# EasyEDA Pro project Flyback_circuit_2024-07-31.epro

# Schematic Schematic1

## Sheets
1 DC_in: Create Date: 2024-07-19; Page Name: DC_in.Schematic1; Project Name: Flyback_circuit; Schematic Name: Schematic1; Update Date: 2024-07-20; Company: 嘉立创EDA; Page Size: A4; Version: V1.0
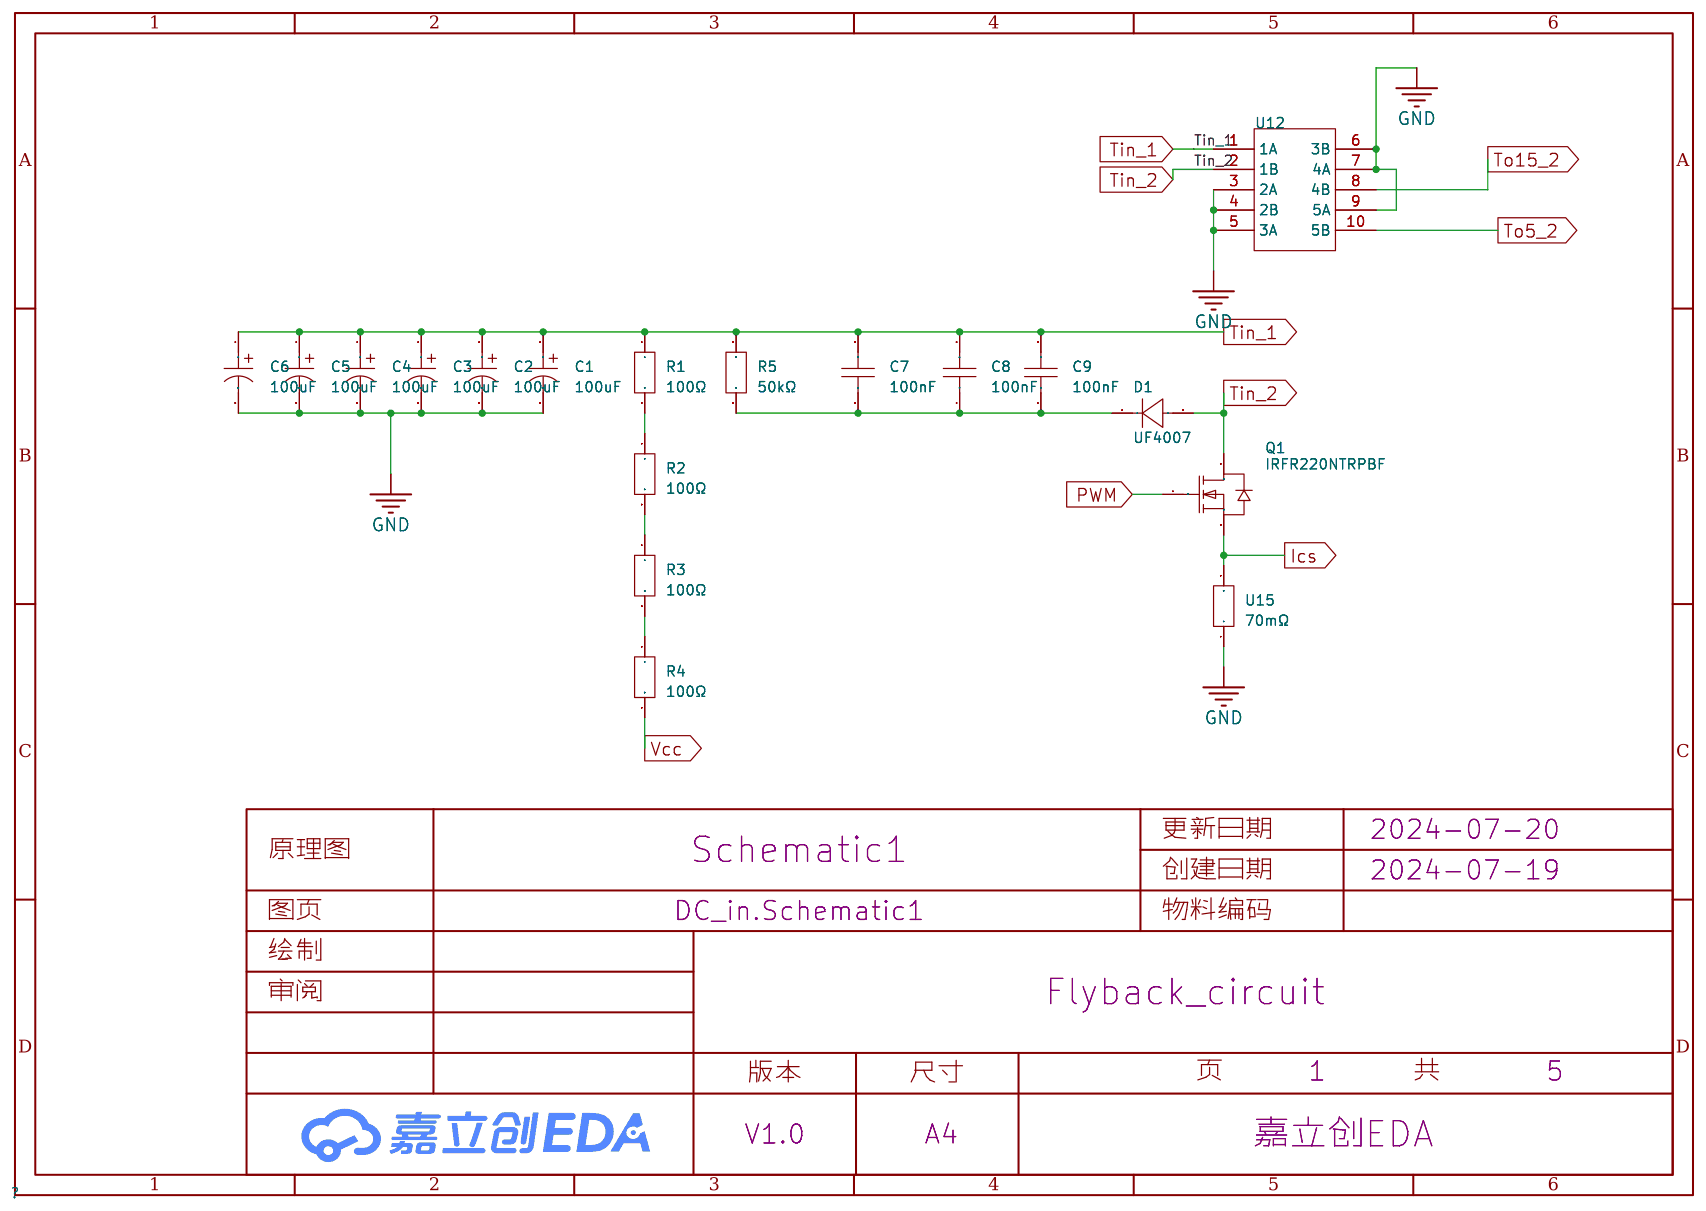
[diagram p0: DC_in]
2 DC_out_5v: Create Date: 2024-07-20; Page Name: DC_out_5v; Update Date: 2024-07-21
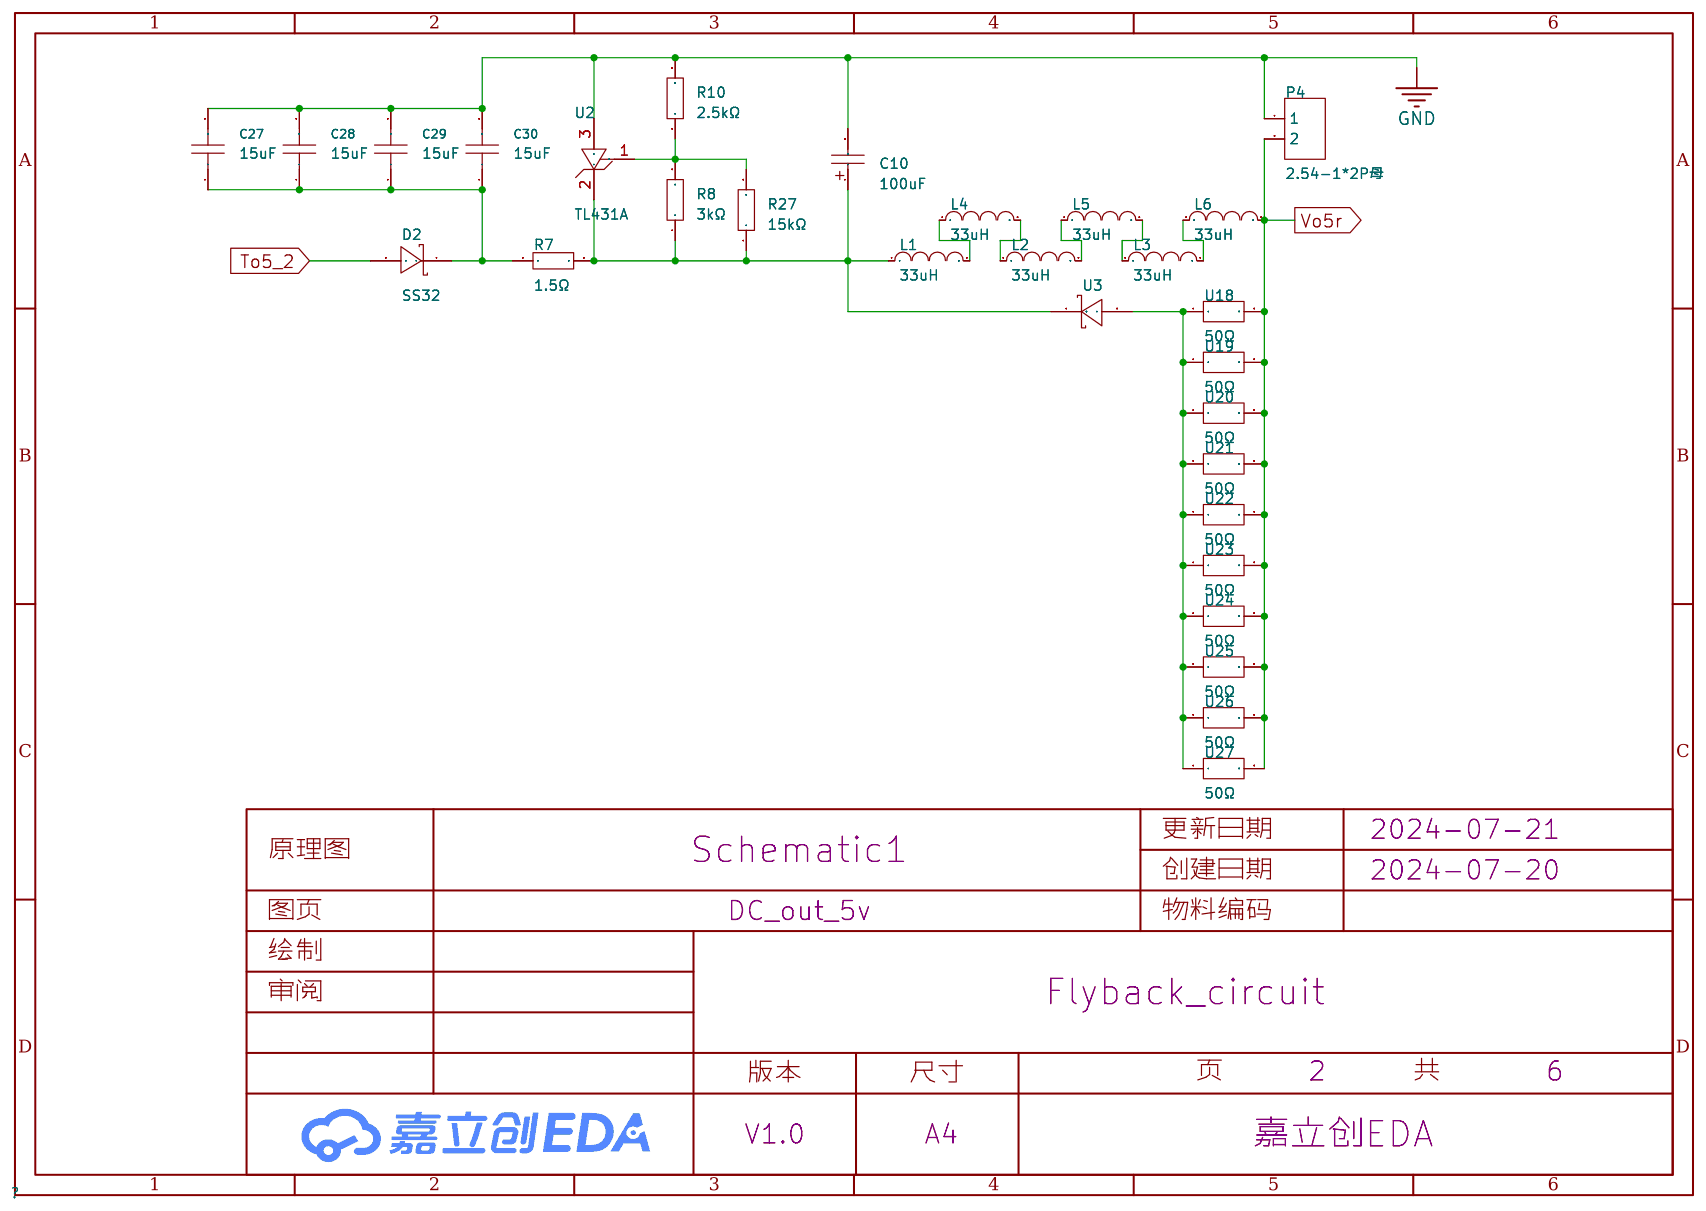
[diagram p1: DC_out_5v]
3 DC_out_15v: Create Date: 2024-07-20; Page Name: DC_out_15v.Schematic1
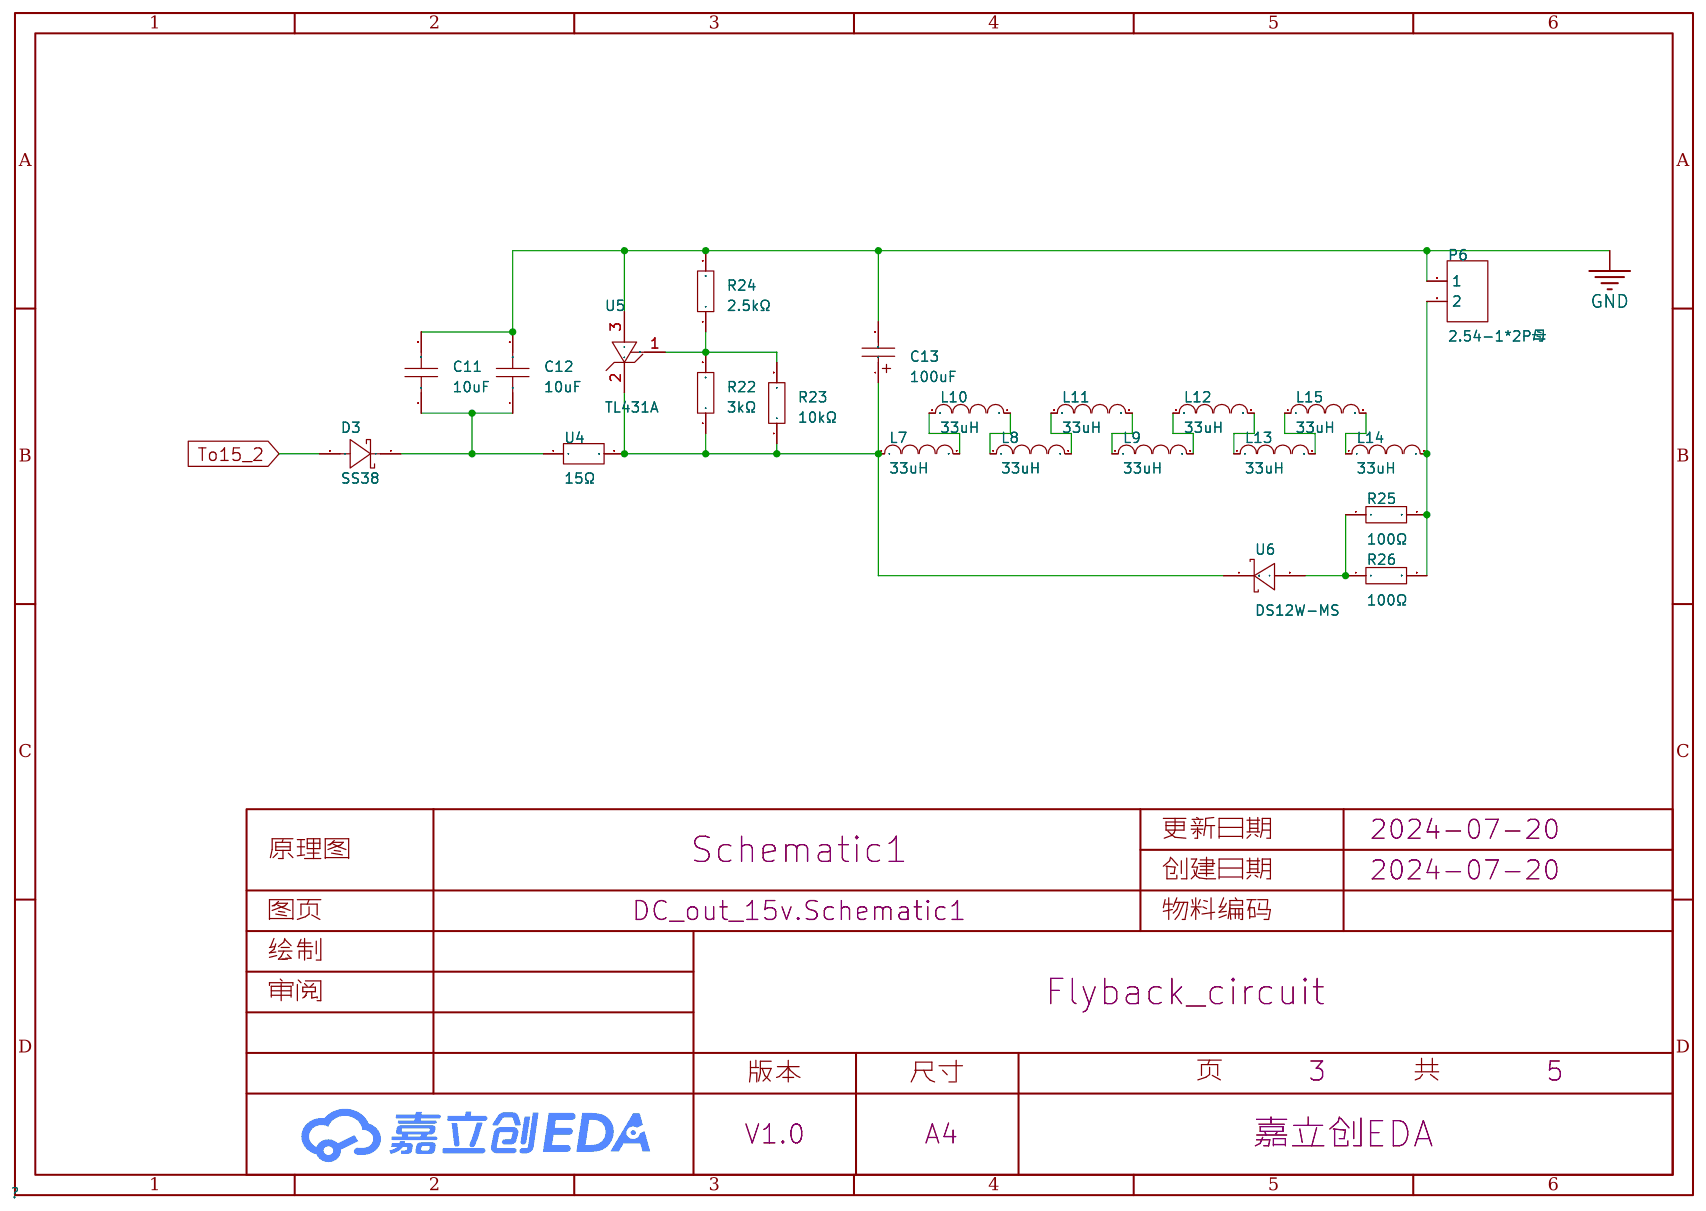
[diagram p2: DC_out_15v]
4 Sample_Circuit: Create Date: 2024-07-20; Page Name: Sample_Circuit; Update Date: 2024-07-21
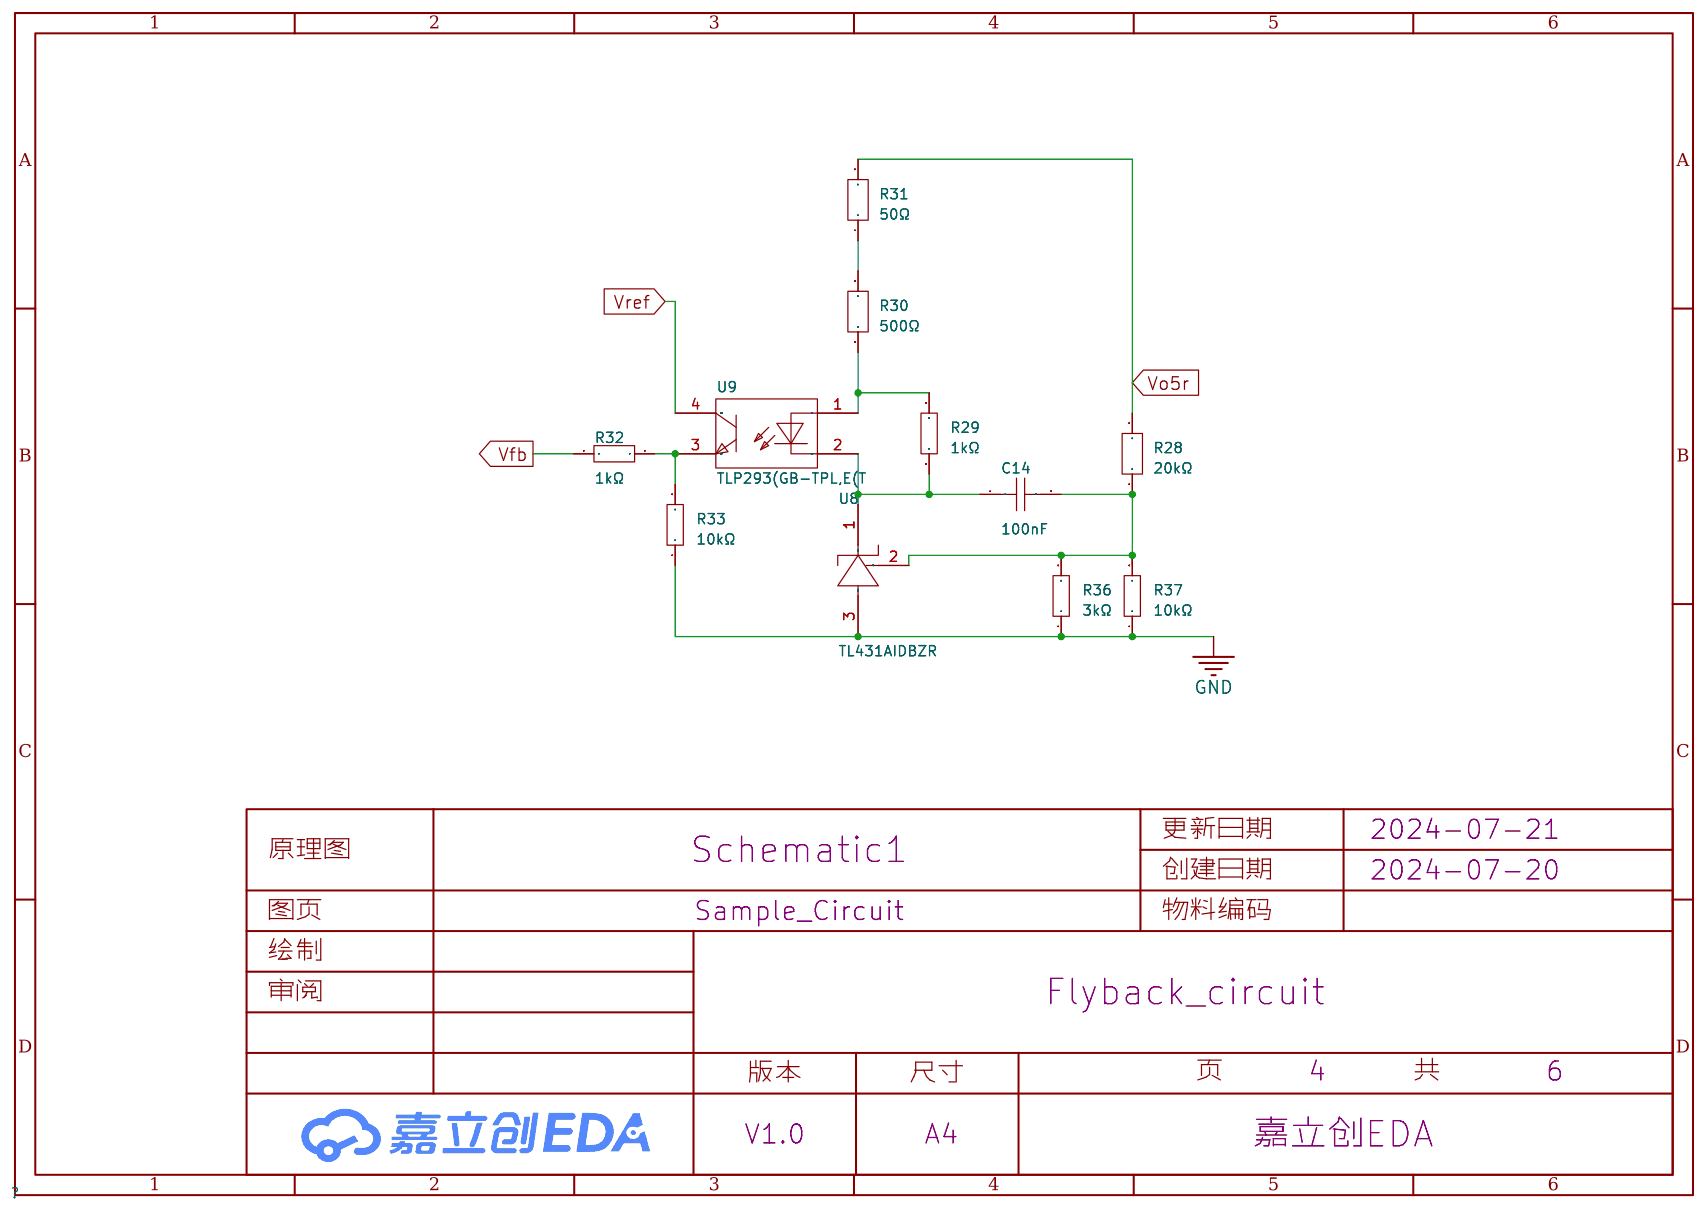
[diagram p3: Sample_Circuit]
5 Chip_Circuit: Create Date: 2024-07-20; Page Name: Chip_Circuit.Schematic1
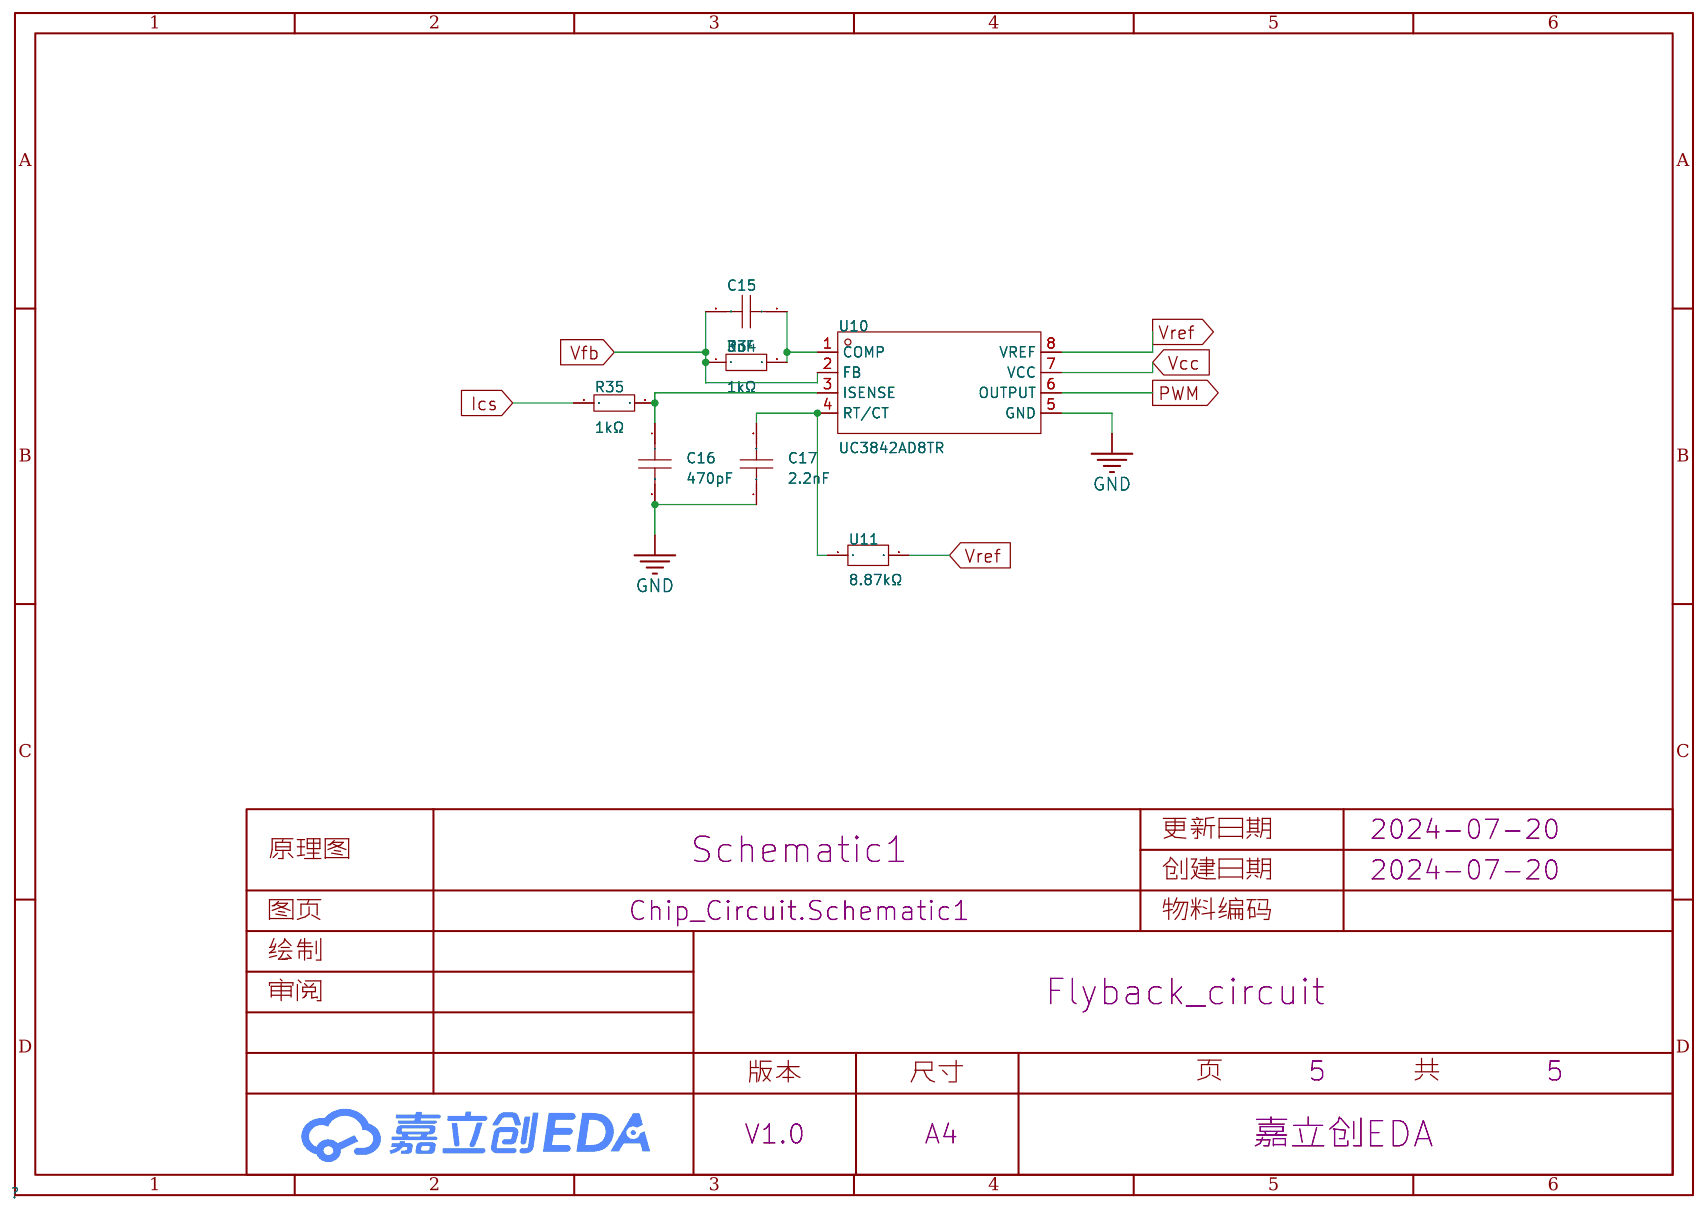
[diagram p4: Chip_Circuit]
6 AC2DC: Create Date: 2024-07-20; Page Name: AC2DC
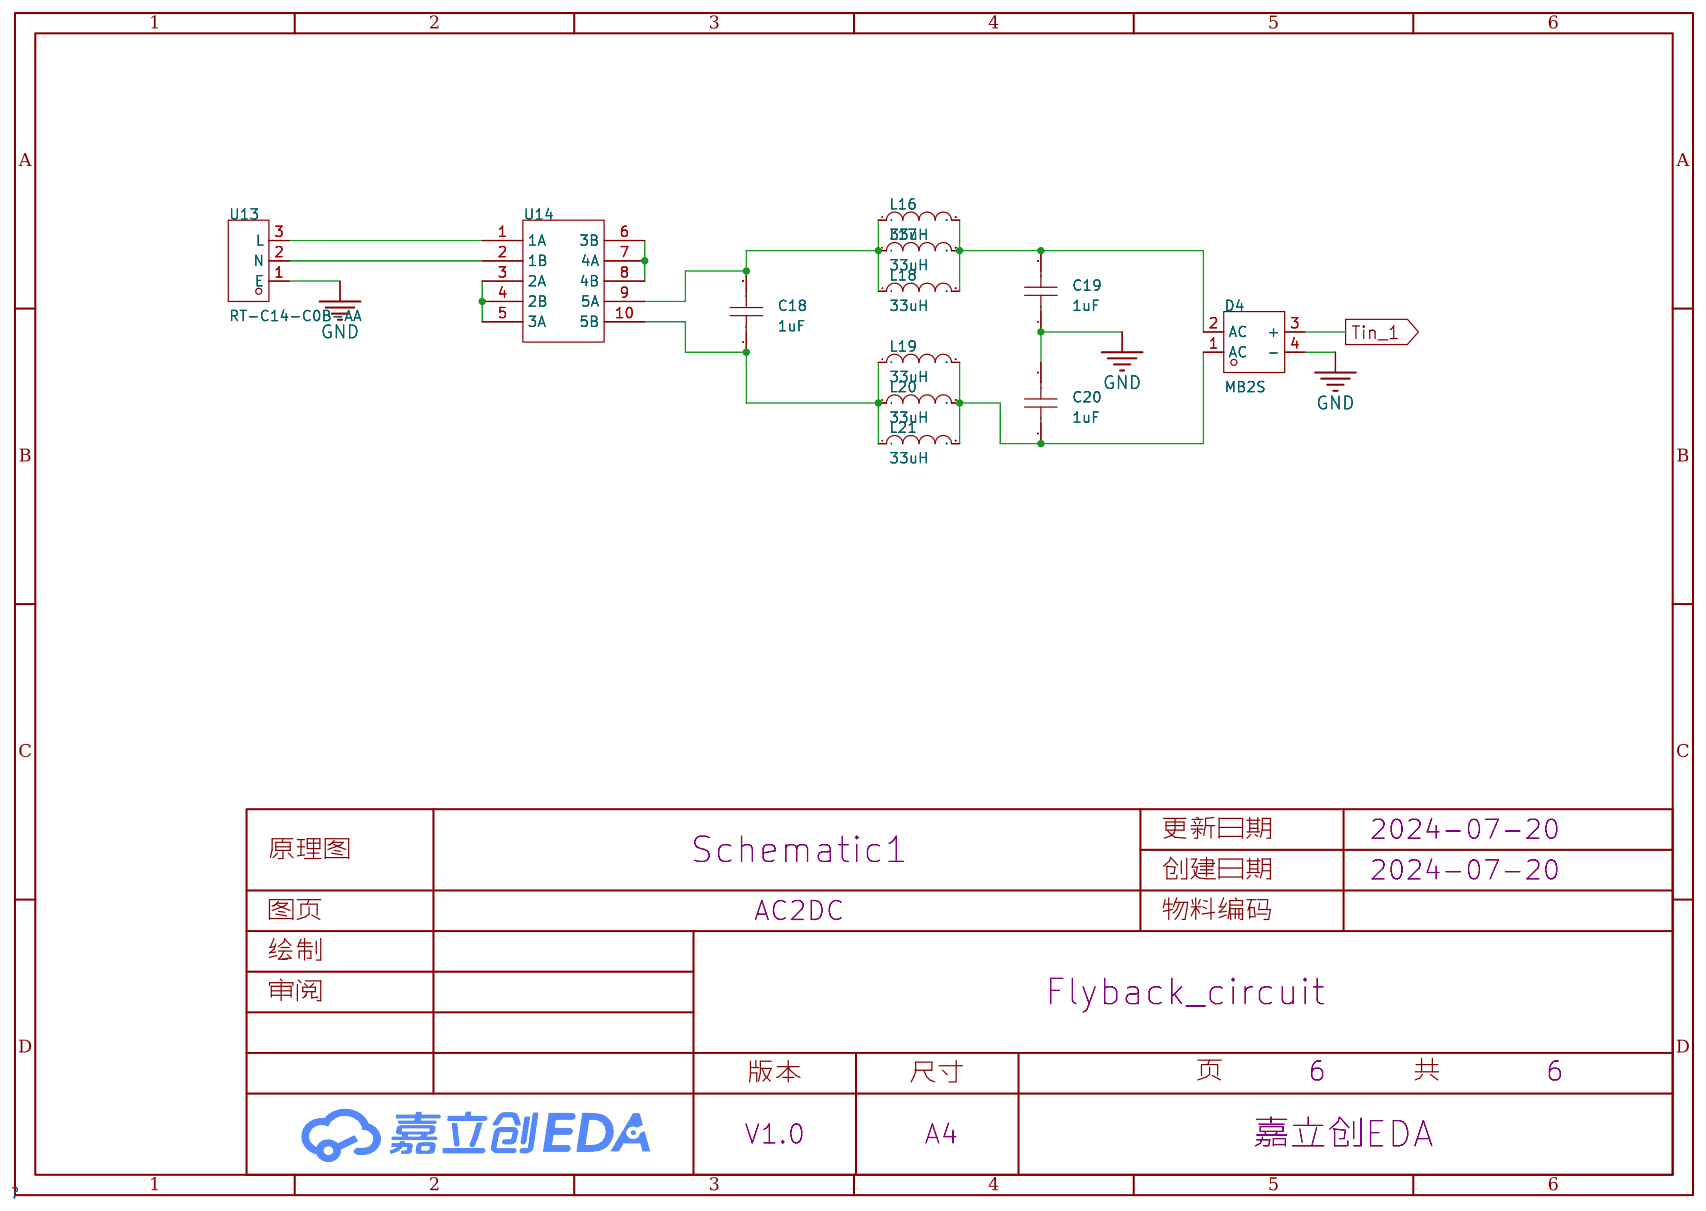
[diagram p5: AC2DC]

## Parts
sheet AC2DC
C18  1uF  [C1206]
C19  1uF  [C1206]
C20  1uF  [C1206]
D4  MB2S  [MBS_L4.7-W4.0-P2.50-LS7.0-BL]
L16  33uH  [IND-SMD_L7.0-W6.6_FXL0650]
L17  33uH  [IND-SMD_L7.0-W6.6_FXL0650]
L18  33uH  [IND-SMD_L7.0-W6.6_FXL0650]
L19  33uH  [IND-SMD_L7.0-W6.6_FXL0650]
L20  33uH  [IND-SMD_L7.0-W6.6_FXL0650]
L21  33uH  [IND-SMD_L7.0-W6.6_FXL0650]
U13  RT-C14-C0B-AA  [AC-TH_RT-C14-C0B-AA]
U14  -  [反激变压器_封装]
sheet Chip_Circuit
C15  3nF  [C0402]
C16  470pF  [C0805]
C17  2.2nF  [C0603]
R34  1kΩ  [R0603]
R35  1kΩ  [R0603]
U10  UC3842AD8TR  [SOIC-8_L4.9-W3.9-P1.27-LS6.0-BL]
U11  8.87kΩ  [R0603]
sheet DC_in
C1  100uF  [CAP-SMD_BD6.3-L6.6-W6.6-LS7.4-FD]
C2  100uF  [CAP-SMD_BD6.3-L6.6-W6.6-LS7.4-FD]
C3  100uF  [CAP-SMD_BD6.3-L6.6-W6.6-LS7.4-FD]
C4  100uF  [CAP-SMD_BD6.3-L6.6-W6.6-LS7.4-FD]
C5  100uF  [CAP-SMD_BD6.3-L6.6-W6.6-LS7.4-FD]
C6  100uF  [CAP-SMD_BD6.3-L6.6-W6.6-LS7.4-FD]
C7  100nF  [C0603]
C8  100nF  [C0603]
C9  100nF  [C0603]
D1  UF4007  [DO-41_BD2.4-L4.7-P8.70-D0.9-RD]
Q1  IRFR220NTRPBF  [TO-252-2_L6.6-W6.1-P4.57-LS9.9-TR-CW]
R1  100Ω  [R2010]
R2  100Ω  [R2010]
R3  100Ω  [R2010]
R4  100Ω  [R2010]
R5  50kΩ  [R0805]
U12  -  [反激变压器_封装]
U15  70mΩ  [R1206]
sheet DC_out_5v
C10  100uF  [CAP-SMD_L3.5-W2.8-R-RD]
C27  15uF  [CAP-TH_L5.5-W4.0-P2.50-D1.0]
C28  15uF  [CAP-TH_L5.5-W4.0-P2.50-D1.0]
C29  15uF  [CAP-TH_L5.5-W4.0-P2.50-D1.0]
C30  15uF  [CAP-TH_L5.5-W4.0-P2.50-D1.0]
D2  SS32  [SMA_L4.3-W2.6-LS5.2-RD]
L1  33uH  [IND-SMD_L7.0-W6.6_FXL0630]
L2  33uH  [IND-SMD_L7.0-W6.6_FXL0630]
L3  33uH  [IND-SMD_L7.0-W6.6_FXL0630]
L4  33uH  [IND-SMD_L7.0-W6.6_FXL0630]
L5  33uH  [IND-SMD_L7.0-W6.6_FXL0630]
L6  33uH  [IND-SMD_L7.0-W6.6_FXL0630]
P4  2.54-1*2P母  [HDR-TH_2P-P2.54-V-F]
R7  1.5Ω  [RES-TH_BD1.9-L3.3-P7.30-D0.5]
R8  3kΩ  [R0402]
R10  2.5kΩ  [R0603]
R27  15kΩ  [R0603]
U2  TL431A  [SOT-23-3_L2.9-W1.3-P1.90-LS2.4-BR]
U3  DS12W-MS  [SOD-123FL_L2.7-W1.8-LS3.8-RD]
U18  50Ω  [R0603]
U19  50Ω  [R0603]
U20  50Ω  [R0603]
U21  50Ω  [R0603]
U22  50Ω  [R0603]
U23  50Ω  [R0603]
U24  50Ω  [R0603]
U25  50Ω  [R0603]
U26  50Ω  [R0603]
U27  50Ω  [R0603]
sheet DC_out_15v
C11  10uF  [C1210]
C12  10uF  [C1210]
C13  100uF  [CASE-D_7343]
D3  SS38  [SMA_L4.3-W2.6-LS5.0-RD]
L7  33uH  [IND-SMD_L7.0-W6.6_FXL0630]
L8  33uH  [IND-SMD_L7.0-W6.6_FXL0630]
L9  33uH  [IND-SMD_L7.0-W6.6_FXL0630]
L10  33uH  [IND-SMD_L7.0-W6.6_FXL0630]
L11  33uH  [IND-SMD_L7.0-W6.6_FXL0630]
L12  33uH  [IND-SMD_L7.0-W6.6_FXL0630]
L13  33uH  [IND-SMD_L7.0-W6.6_FXL0630]
L14  33uH  [IND-SMD_L7.0-W6.6_FXL0630]
L15  33uH  [IND-SMD_L7.0-W6.6_FXL0630]
P6  2.54-1*2P母  [HDR-TH_2P-P2.54-V-F]
R22  3kΩ  [R0402]
R23  10kΩ  [R0603]
R24  2.5kΩ  [R0603]
R25  100Ω  [R0603]
R26  100Ω  [R0603]
U4  15Ω  [RES-TH_L48.0-W12.5-P52.00-D0.8]
U5  TL431A  [SOT-23-3_L2.9-W1.3-P1.90-LS2.4-BR]
U6  DS12W-MS  [SOD-123FL_L2.7-W1.8-LS3.8-RD]
sheet Sample_Circuit
C14  100nF  [C0603]
R28  20kΩ  [R0603]
R29  1kΩ  [R0603]
R30  500Ω  [R0805]
R31  50Ω  [R0805]
R32  1kΩ  [R0603]
R33  10kΩ  [R0805]
R36  3kΩ  [R0603]
R37  10kΩ  [R0805]
U8  TL431AIDBZR  [SOT-23-3_L2.9-W1.6-P1.90-LS2.8-BR]
U9  TLP293(GB-TPL,E(T  [SO-4_L4.6-W2.6-P1.27-LS7.0]

## Library data of the parts
C18-C20 = CL31B105KCHNNNE: 容值:1uF;精度:±10%;额定电压:100V;材质(温度系数):X7R;; LCSC Part Name: 1uF ±10% 100V; Supplier Part: C13832; Manufacturer: SAMSUNG(三星); Supplier Footprint: 1206; JLCPCB Part Class: 扩展库; Datasheet: https://atta.szlcsc.com/upload/public/pdf/source/20160218/1457707763339.pdf; Supplier: LCSC; Tolerance: ±10%; Voltage Rated: 100V; Temperature Coefficient: X7R
D4 = MB2S_C437884: 正向压降(Vf):1.1V@800mA;直流反向耐压(Vr):200V;平均整流电流(Io):800mA;正向浪涌电流(Ifsm):30A;; LCSC Part Name: 电压:200V 电流:800mA; Supplier Part: C437884; Manufacturer: 晶导微电子; Supplier Footprint: MBS; JLCPCB Part Class: 扩展库; Datasheet: https://atta.szlcsc.com/upload/public/pdf/source/20191017/C437885_78403EC43C3D3B4514D5BE8C62D6D5FC.pdf; Supplier: LCSC; Forward Voltage (Vf@If): 1.1V@800mA; Reverse Voltage (Vr): 200V; Average Rectified Current (Io): 800mA; Reverse Leakage Current (Ir): 5uA@200V; Peak Forward Surge Current: 30A; Operating Temperature: -55℃~+150℃@(Tj)
L16-L21 = FXL0650-330-M: 电感值:33uH;精度:±20%;额定电流:2.3A;饱和电流(Isat):3A;类型:一体成型电感;; LCSC Part Name: 33uH ±20% 3A; Supplier Part: C475526; Manufacturer: cjiang(长江微电); Supplier Footprint: SMD,6.6x7mm; JLCPCB Part Class: 扩展库; Datasheet: https://atta.szlcsc.com/upload/public/pdf/source/20230516/677FF0B270D5BF5CC59B858CE23820C0.pdf; Supplier: LCSC; Tolerance: ±20%; Rated Current: 2.3A; Saturation Current (Isat): 3A; DC Resistance (DCR): 190mΩ; Type: 一体成型电感
U13 = RT-C14-C0B-AA: Supplier Part: C309253; Manufacturer: ROCKTEK(富力隆); Supplier Footprint: 插件; JLCPCB Part Class: 扩展库; Datasheet: https://atta.szlcsc.com/upload/public/pdf/source/20190108/C309253_EE4EAE919D1AC1E1E69D26CD4EB647D7.pdf; Supplier: LCSC
U12 U14 = 反激变压器_自定义
C15 = GRM1557U1A302JA01D: 容值:3nF;精度:±5%;额定电压:10V;材质(温度系数):U2J;; LCSC Part Name: 3nF ±5% 10V; Supplier Part: C162145; Manufacturer: muRata(村田); Supplier Footprint: 0402; JLCPCB Part Class: 扩展库; Datasheet: https://atta.szlcsc.com/upload/public/pdf/source/20181011/C162145_C9D70EF3A42E4C148C2898828ED8AD69.pdf; Supplier: LCSC; Tolerance: ±5%; Voltage Rated: 10V; Temperature Coefficient: U2J
C16 = ECHU1H471JX5: 容值:470pF;精度:±5%;额定电压:50V;介电材料:金属化聚苯硫醚;工作温度:-55℃~+125℃;; LCSC Part Name: 470pF ±5% 50V; Supplier Part: C178429; Manufacturer: PANASONIC(松下); Supplier Footprint: 0805; JLCPCB Part Class: 扩展库; Datasheet: https://atta.szlcsc.com/upload/public/pdf/source/20180224/C179170_15194367824681363791.pdf; Supplier: LCSC; Tolerance: ±5%; Voltage Rated: 50V; Dielectric Material: 金属化聚苯硫醚; Operating Temperature: -55℃~+125℃
C17 = GCM1885C1H222FA16D: 容值:2.2nF;精度:±1%;额定电压:50V;材质(温度系数):C0G;; LCSC Part Name: 2.2nF ±1% 50V; Supplier Part: C882578; Manufacturer: muRata(村田); Supplier Footprint: 0603; JLCPCB Part Class: 扩展库; Datasheet: https://atta.szlcsc.com/upload/public/pdf/source/20201228/C882578_EDF992AD6064A2D085B371C371799E69.pdf; Supplier: LCSC; Tolerance: ±1%; Voltage Rated: 50V; Temperature Coefficient: C0G
R32 R34 R35 = 0603WAF1001T5E: 电阻类型:厚膜电阻;阻值:1kΩ;精度:±1%;功率:100mW;最大工作电压:75V;温度系数:±100ppm/℃;; LCSC Part Name: 1kΩ ±1% 100mW 厚膜电阻; Supplier Part: C21190; Manufacturer: UNI-ROYAL(厚声); Supplier Footprint: 0603; JLCPCB Part Class: 基础库; Datasheet: https://atta.szlcsc.com/upload/public/pdf/source/20200306/C422600_1E6D84923E4A46A82E41ADD87F860B5C.pdf; Supplier: LCSC; Type: 厚膜电阻; Tolerance: ±1%; Power(Watts): 100mW; Overload Voltage (Max): 75V; Temperature Coefficient: ±100ppm/℃; Operating Temperature Range: -55℃~+155℃
U10 = UC3842AD8TR: 电源电压:10V~30V;开关频率:500kHz;; Supplier Part: C182337; Manufacturer: TI(德州仪器); Supplier Footprint: SOIC-8; JLCPCB Part Class: 扩展库; Datasheet: https://www.ti.com/cn/lit/gpn/uc3842a; Supplier: LCSC; Supply Voltage: 10V~30V; Switching Frequency: 500kHz; Duty Cycle: 96%; Topology: 反激式；升压式；正激式；降压式; Operating Temperature: 0℃~+70℃@(Ta)
U11 = FRC0603F8871TS: 电阻类型:厚膜电阻;阻值:8.87kΩ;精度:±1%;功率:100mW;最大工作电压:75V;温度系数:±100ppm/℃;; LCSC Part Name: 8.87kΩ ±1% 100mW 厚膜电阻; Supplier Part: C2998144; Manufacturer: FOJAN(富捷); Supplier Footprint: 0603; JLCPCB Part Class: 扩展库; Datasheet: https://atta.szlcsc.com/upload/public/pdf/source/20211221/925EC7D7225764EE0046F22065062C87.pdf; Supplier: LCSC; Type: 厚膜电阻; Tolerance: ±1%; Power(Watts): 100mW; Overload Voltage (Max): 75V; Temperature Coefficient: ±100ppm/℃; Operating Temperature Range: -55℃~+155℃
C1-C6 = RVT100UF35V67RV0034: 容值:100uF;精度:±20%;额定电压:35V;纹波电流:87mA@120kHz;等效串联电阻:-;; LCSC Part Name: 100uF ±20% 35V; Supplier Part: C2836442; Manufacturer: KNSCHA(科尼盛); Supplier Footprint: SMD,D6.3xL7.7mm; JLCPCB Part Class: 扩展库; Datasheet: https://atta.szlcsc.com/upload/public/pdf/source/20210528/C2836442_7F6389BF36F63F32D6DF3A507E8E95D6.pdf; Supplier: LCSC; Tolerance: ±20%; Rated Voltage: 35V; Ripple Current: 87mA@120kHz; φD: 6.3mm; L: 7.7mm; Lifetime @ Temp: 2000hrs@105℃; Operating Temperature: -55℃~+105℃
C7-C9 = CC0603KRX7R9BB104: 容值:100nF;精度:±10%;额定电压:50V;材质(温度系数):X7R;; LCSC Part Name: 100nF ±10% 50V; Supplier Part: C14663; Manufacturer: YAGEO(国巨); Supplier Footprint: 0603; JLCPCB Part Class: 基础库; Datasheet: https://atta.szlcsc.com/upload/public/pdf/source/20180910/C282072_33301C7F631E79921B82A8DAC6BCC5B3.pdf; Supplier: LCSC; Tolerance: ±10%; Voltage Rated: 50V; Temperature Coefficient: X7R
D1 = UF4007_C960666: 二极管配置:-;正向压降(Vf):1.7V@1A;直流反向耐压(Vr):1kV;整流电流:1A;反向恢复时间(trr):75ns;; LCSC Part Name: 电压:1kV 电流:1A; Supplier Part: C960666; Manufacturer: MDD(辰达半导体); Supplier Footprint: DO-41; JLCPCB Part Class: 扩展库; Datasheet: https://atta.szlcsc.com/upload/public/pdf/source/20230823/1B30A65DCB3ACA14005A2F03886CEF7C.pdf; Supplier: LCSC; Forward Voltage (Vf@If): 1.7V@1A; Reverse Voltage (Vr): 1kV; Rectified Current: 1A; Reverse Leakage Current: 5uA@1kV; Reverse Recovery Time (trr): 75ns; Operating Temperature: -50℃~+150℃@(Tj)
Q1 = IRFR220NTRPBF: 类型:1个N沟道;漏源电压(Vdss):200V;连续漏极电流(Id):5A;功率(Pd):43W;导通电阻(RDS(on)@Vgs,Id):600mΩ@10V,2.9A;阈值电压(Vgs(th)@Id):4V@250uA;; LCSC Part Name: 1个N沟道 耐压:200V 电流:5A; Supplier Part: C2584; Manufacturer: Infineon(英飞凌); Supplier Footprint: TO-252-2(DPAK); JLCPCB Part Class: 扩展库; Datasheet: https://atta.szlcsc.com/upload/public/pdf/source/20200323/C500528_AD38F318A115118F4DB56F5A4EA6919E.pdf; Supplier: LCSC; Type: 1个N沟道; Drain Source Voltage (Vdss): 200V; Continuous Drain Current (Id): 5A; Power Dissipation (Pd): 43W; Drain Source On Resistance (RDS(on)@Vgs,Id): 600mΩ@10V,2.9A; Gate Threshold Voltage (Vgs(th)@Id): 4V@250uA; Total Gate Charge (Qg@Vgs): 23nC@10V; Input Capacitance (Ciss@Vds): 300pF@25V; Operating Temperature: -55℃~+175℃@(Tj)
R1-R4 = AS101AJ0101T4E: 电阻类型:厚膜电阻;阻值:100Ω;精度:±5%;功率:1.5W;最大工作电压:400V;温度系数:±100ppm/℃;; LCSC Part Name: 100Ω ±5% 1.5W 厚膜电阻; Supplier Part: C965994; Manufacturer: UNI-ROYAL(厚声); Supplier Footprint: 2010; JLCPCB Part Class: 扩展库; Datasheet: https://atta.szlcsc.com/upload/public/pdf/source/20200723/C560412_34ABBCC623B52ADD707B94178459E29E.pdf; Supplier: LCSC; Type: 厚膜电阻; Tolerance: ±5%; Power(Watts): 1.5W; Overload Voltage (Max): 400V; Temperature Coefficient: ±100ppm/℃; Operating Temperature Range: -55℃~+155℃
R5 = ARG05DTC5002: 电阻类型:薄膜电阻;阻值:50kΩ;精度:±0.5%;功率:125mW;最大工作电压:150V;温度系数:±25ppm/℃;; LCSC Part Name: 薄膜电阻 50kΩ ±0.5% 125mW; Supplier Part: C2828840; Manufacturer: Viking(光颉); Supplier Footprint: 0805; JLCPCB Part Class: 扩展库; Datasheet: https://atta.szlcsc.com/upload/public/pdf/source/20210426/C2828737_35D2DDB0BDDA00747C2712435E28BBD4.pdf; Supplier: LCSC; Type: 薄膜电阻; Tolerance: ±0.5%; Power(Watts): 125mW; Overload Voltage (Max): 150V; Temperature Coefficient: ±25ppm/℃; Operating Temperature Range: -55℃~+155℃
U15 = PE1206FRM7W0R07L: 电阻类型:薄膜电阻;阻值:70mΩ;精度:±1%;功率:500mW;最大工作电压:-;温度系数:±75ppm/℃;; LCSC Part Name: 薄膜电阻 70mΩ ±1% 500mW; Supplier Part: C2075306; Manufacturer: YAGEO(国巨); Supplier Footprint: 1206; JLCPCB Part Class: 扩展库; Datasheet: https://atta.szlcsc.com/upload/public/pdf/source/20211020/C6103334F76DC954DA6F525702694423.pdf; Supplier: LCSC; Type: 薄膜电阻; Tolerance: ±1%; Power(Watts): 500mW; Temperature Coefficient: ±75ppm/℃; Operating Temperature Range: -55℃~+170℃
C10 = CA45-B010K107T: 容值:100uF;精度:±10%;额定电压:10V;等效串联电阻:1.4Ω@100kHz;; LCSC Part Name: 100uF ±10% 10V; Supplier Part: C122644; Manufacturer: 湘怡中元/湘江; Supplier Footprint: CASE-B-3528; JLCPCB Part Class: 扩展库; Datasheet: https://atta.szlcsc.com/upload/public/pdf/source/20191009/C435293_78A410F3D73489DBEAC46056C4262F7A.pdf; Supplier: LCSC; Tolerance: ±10%; Rated Voltage: 10V; Equivalent Series Resistance(ESR): 1.4Ω@100kHz; Operating Temperature: -55℃~+125℃
C27-C30 = FG11X7R1C156MRT06: 容值:15uF;精度:±20%;额定电压:16V;温度系数:X7R;; LCSC Part Name: 15uF ±20% 16V; Supplier Part: C342640; Manufacturer: TDK; Supplier Footprint: 插件,P=2.5mm; JLCPCB Part Class: 扩展库; Datasheet: https://atta.szlcsc.com/upload/public/pdf/source/20191105/C448597_83F7E85420DB990C4EBF9258CA585DFF.pdf; Supplier: LCSC; Tolerance: ±20%; Voltage Rated: 16V; Temperature Coefficient: X7R
D2 = SS32_C34897: 二极管配置:独立式;正向压降(Vf):550mV@3A;直流反向耐压(Vr):20V;整流电流:3A;; LCSC Part Name: 电压:20V 电流:3A; Supplier Part: C34897; Manufacturer: MDD(辰达半导体); Supplier Footprint: SMA(DO-214AC); JLCPCB Part Class: 扩展库; Datasheet: https://atta.szlcsc.com/upload/public/pdf/source/20230314/A80AE34493C69B89E2F4B1712F433538.pdf; Supplier: LCSC; Diode Configuration: 独立式; Forward Voltage (Vf@If): 550mV@3A; Reverse Voltage (Vr): 20V; Rectified Current: 3A; Reverse Leakage Current (Ir): 500uA@20V
L1-L15 = FXL0630-330-M: 电感值:33uH;精度:±20%;额定电流:2A;饱和电流(Isat):2.5A;类型:一体成型电感;; LCSC Part Name: 33uH ±20% 2.5A; Supplier Part: C177245; Manufacturer: cjiang(长江微电); Supplier Footprint: SMD,6.6x7mm; JLCPCB Part Class: 扩展库; Datasheet: https://atta.szlcsc.com/upload/public/pdf/source/20230516/3A080F5AF8C87BB81C3BA86E5F60E51A.pdf; Supplier: LCSC; Tolerance: ±20%; Rated Current: 2A; Saturation Current (Isat): 2.5A; DC Resistance (DCR): 310mΩ; Type: 一体成型电感
P4 P6 = 2.54-1*2P母: 插孔结构:1x2P;间距:2.54mm;行距:-;安装类型:直插;排数:单排;总孔位数:2P;塑高:-;触头材质:-;触头镀层:-;; LCSC Part Name: 间距:2.54mm 1x2P 直插; Supplier Part: C49661; Manufacturer: BOOMELE(博穆精密); Supplier Footprint: 插件,P=2.54mm; JLCPCB Part Class: 扩展库; Datasheet: https://atta.szlcsc.com/upload/public/pdf/source/20210301/C2718488_F4427B881E42CAA8DDB0B1C12B3A522C.pdf; Supplier: LCSC; Holes Structure: 1x2P; Pitch: 2.54mm; Mounting Type: 直插; Number of Rows: 单排; Number of Holes: 2P
R7 = RN16T51R50F: 电阻类型:金属膜电阻;阻值:1.5Ω;精度:±1%;功率:166.667mW;温度系数:±100ppm/℃;; LCSC Part Name: 金属膜电阻 1.5Ω ±1% 166.667mW; Supplier Part: C172612; Manufacturer: 大毅科技; Supplier Footprint: 插件,D2.5xL4.7mm; JLCPCB Part Class: 扩展库; Datasheet: https://atta.szlcsc.com/upload/public/pdf/source/20180301/C172697_15198943829781383924.pdf; Supplier: LCSC; Type: 金属膜电阻; Tolerance: ±1%; Overload Voltage (Max): 250V; Power(Watts): 166.667mW; Temperature Coefficient: ±100ppm/℃; Operating Temperature Range: -55℃~+155℃
R8 R22 = RT0402BRD073KL: 电阻类型:薄膜电阻;阻值:3kΩ;精度:±0.1%;功率:62.5mW;最大工作电压:50V;温度系数:±25ppm/℃;; LCSC Part Name: 薄膜电阻 3kΩ ±0.1% 62.5mW; Supplier Part: C281777; Manufacturer: YAGEO(国巨); Supplier Footprint: 0402; JLCPCB Part Class: 扩展库; Datasheet: https://atta.szlcsc.com/upload/public/pdf/source/20181009/C309664_C7CEF5A7F4D0541F96EF5E54D941D229.pdf; Supplier: LCSC; Type: 薄膜电阻; Tolerance: ±0.1%; Power(Watts): 62.5mW; Overload Voltage (Max): 50V; Temperature Coefficient: ±25ppm/℃; Operating Temperature Range: -55℃~+155℃
R10 R24 = AR03BTC2501: 阻值:2.5kΩ;精度:±0.1%;功率:62.5mW;温度系数:±25ppm/℃;; LCSC Part Name: 2.5kΩ ±0.1% 62.5mW; Supplier Part: C304065; Manufacturer: Viking(光颉); Supplier Footprint: 0603; JLCPCB Part Class: 扩展库; Datasheet: https://atta.szlcsc.com/upload/public/pdf/source/20191129/C465721_10D49275DB41E427863CE9C8D788770A.pdf; Supplier: LCSC; Tolerance: ±0.1%; Power(Watts): 62.5mW; Temperature Coefficient: ±25ppm/℃
R27 = 0603WAF1502T5E: 电阻类型:厚膜电阻;阻值:15kΩ;精度:±1%;功率:100mW;最大工作电压:75V;温度系数:±100ppm/℃;; LCSC Part Name: 15kΩ ±1% 100mW 厚膜电阻; Supplier Part: C22809; Manufacturer: UNI-ROYAL(厚声); Supplier Footprint: 0603; JLCPCB Part Class: 基础库; Datasheet: https://atta.szlcsc.com/upload/public/pdf/source/20200306/C422600_1E6D84923E4A46A82E41ADD87F860B5C.pdf; Supplier: LCSC; Type: 厚膜电阻; Tolerance: ±1%; Power(Watts): 100mW; Overload Voltage (Max): 75V; Temperature Coefficient: ±100ppm/℃; Operating Temperature Range: -55℃~+155℃
U2 U5 = TL431A: 输出类型:可调;输入电压:37V;输出电压:2.495V~36V;输出电流:100mA;精度:±0.5%;; Supplier Part: C411753; Manufacturer: PJSEMI(平晶微); Supplier Footprint: SOT-23; JLCPCB Part Class: Extended Part; Datasheet: https://atta.szlcsc.com/upload/public/pdf/source/20190819/C411753_12F949F6FF6688FC09D63250AB28F55F.pdf; Supplier: LCSC; Output Type: 可调; Input Voltage: 37V; Output Voltage: 2.495V~36V; Output Current: 100mA; Tolerance: ±0.5%; Minimum Cathode Current for Regulation: 1mA; Operating Temperature: -40℃~+125℃
U3 U6 = DS12W-MS: 二极管配置:独立式;正向压降(Vf):550mV@1A;直流反向耐压(Vr):20V;平均整流电流(Io):1A;; LCSC Part Name: 电压:20V 电流:1A; Supplier Part: C5120757; Manufacturer: MSKSEMI(美森科); Supplier Footprint: SOD-123FL; JLCPCB Part Class: Extended Part; Datasheet: https://atta.szlcsc.com/upload/public/pdf/source/20220727/A9AC0F98CD35BCE10106007BF4402194.pdf; Supplier: LCSC; Diode Configuration: 独立式; Forward Voltage (Vf@If): 550mV@1A; Reverse Voltage (Vr): 20V; Average Rectified Current (Io): 1A; Reverse Leakage Current: 500uA@20V
U18-U27 = RT0603BRE0750RL: 电阻类型:薄膜电阻;阻值:50Ω;精度:±0.1%;功率:100mW;温度系数:±50ppm/℃;; LCSC Part Name: 薄膜电阻 50Ω ±0.1% 100mW; Supplier Part: C849792; Manufacturer: YAGEO(国巨); Supplier Footprint: 0603; JLCPCB Part Class: 扩展库; Datasheet: https://atta.szlcsc.com/upload/public/pdf/source/20200610/C326738_5639A9F1B6EB6E4AE2197577D3456E7F.pdf; Supplier: LCSC; Type: 薄膜电阻; Tolerance: ±0.1%; Power(Watts): 100mW; Temperature Coefficient: ±50ppm/℃; Operating Temperature Range: -55℃~+155℃
C11 C12 = FS32X106K101EGG: 容值:10uF;精度:±10%;额定电压:100V;材质(温度系数):X7R;; LCSC Part Name: 10uF ±10% 100V; Supplier Part: C5156756; Manufacturer: PSA(信昌电陶); Supplier Footprint: 1210; JLCPCB Part Class: 扩展库; Datasheet: https://atta.szlcsc.com/upload/public/pdf/source/20220906/2A42A90825742552985FFB5A7BAB200E.pdf; Supplier: LCSC; Tolerance: ±10%; Voltage Rated: 100V; Temperature Coefficient: X7R
C13 = TAJD107K020RNJ: 容值:100uF;精度:±10%;额定电压:20V;等效串联电阻:500mΩ@100kHz;; LCSC Part Name: 100uF ±10% 20V; Supplier Part: C7224; Manufacturer: Kyocera AVX; Supplier Footprint: CASE-D-7343; JLCPCB Part Class: 扩展库; Datasheet: https://atta.szlcsc.com/upload/public/pdf/source/20160107/1457707750344.pdf; Supplier: LCSC; Tolerance: ±10%; Rated Voltage: 20V; Equivalent Series Resistance(ESR): 500mΩ@100kHz; Operating Temperature: -55℃~+125℃
D3 = SS38_C18199196: 二极管配置:独立式;正向压降(Vf):850mV@3A;直流反向耐压(Vr):80V;平均整流电流(Io):3A;; LCSC Part Name: 电压:80V 电流:3A; Supplier Part: C18199196; Manufacturer: 宏迦橙; Supplier Footprint: SMA(DO-214AC); Datasheet: https://atta.szlcsc.com/upload/public/pdf/source/20231013/852E89A73EC99538C59666363874C9DC.pdf; Supplier: LCSC; Diode Configuration: 独立式; Forward Voltage (Vf@If): 850mV@3A; Reverse Voltage (Vr): 80V; Average Rectified Current (Io): 3A; Reverse Leakage Current (Ir): 50uA@80V; Peak forward surge current: 80A
R23 = 0603WAF1002T5E: 电阻类型:厚膜电阻;阻值:10kΩ;精度:±1%;功率:100mW;最大工作电压:75V;温度系数:±100ppm/℃;; LCSC Part Name: 厚膜电阻 10kΩ ±1% 100mW; Supplier Part: C25804; Manufacturer: UNI-ROYAL(厚声); Supplier Footprint: 0603; JLCPCB Part Class: 基础库; Datasheet: https://atta.szlcsc.com/upload/public/pdf/source/20200306/C422600_1E6D84923E4A46A82E41ADD87F860B5C.pdf; Supplier: LCSC; Type: 厚膜电阻; Tolerance: ±1%; Power(Watts): 100mW; Overload Voltage (Max): 75V; Temperature Coefficient: ±100ppm/℃; Operating Temperature Range: -55℃~+155℃
R25 R26 = RC0603FR-07100RL: 电阻类型:厚膜电阻;阻值:100Ω;精度:±1%;功率:100mW;最大工作电压:75V;温度系数:±100ppm/℃;; LCSC Part Name: 厚膜电阻 100Ω ±1% 100mW; Supplier Part: C105588; Manufacturer: YAGEO(国巨); Supplier Footprint: 0603; JLCPCB Part Class: 扩展库; Datasheet: https://atta.szlcsc.com/upload/public/pdf/source/20180316/70C0E2BDAE7FCC62C531A5A58D202EE1.pdf; Supplier: LCSC; Type: 厚膜电阻; Tolerance: ±1%; Power(Watts): 100mW; Overload Voltage (Max): 75V; Temperature Coefficient: ±100ppm/℃; Operating Temperature Range: -55℃~+155℃
U4 = NSP15AJB-15R: 电阻类型:水泥电阻;阻值:15Ω;精度:±5%;功率:15W;温度系数:±300ppm/℃;; LCSC Part Name: 水泥电阻 15Ω ±5% 15W; Supplier Part: C1405354; Manufacturer: YAGEO(国巨); Supplier Footprint: 插件,D12.5xL48mm; JLCPCB Part Class: 扩展库; Datasheet: https://atta.szlcsc.com/upload/public/pdf/source/20210428/3FAF7FC75E28D72F2B297B3ED0003969.pdf; Supplier: LCSC; Type: 水泥电阻; Tolerance: ±5%; Power(Watts): 15W; Temperature Coefficient: ±300ppm/℃; Operating Temperature Range: -55℃~+155℃
C14 = CL10B104KB8NNNC: 容值:100nF;精度:±10%;额定电压:50V;材质(温度系数):X7R;; LCSC Part Name: 100nF ±10% 50V; Supplier Part: C1591; Manufacturer: SAMSUNG(三星); Supplier Footprint: 0603; JLCPCB Part Class: 扩展库; Datasheet: https://atta.szlcsc.com/upload/public/pdf/source/20160218/1457707763339.pdf; Supplier: LCSC; Tolerance: ±10%; Voltage Rated: 50V; Temperature Coefficient: X7R
R28 = RT0603BRD0720KL: 电阻类型:薄膜电阻;阻值:20kΩ;精度:±0.1%;功率:100mW;最大工作电压:75V;温度系数:±25ppm/℃;; LCSC Part Name: 薄膜电阻 20kΩ ±0.1% 100mW; Supplier Part: C723637; Manufacturer: YAGEO(国巨); Supplier Footprint: 0603; JLCPCB Part Class: 扩展库; Datasheet: https://atta.szlcsc.com/upload/public/pdf/source/20200814/C723637_57E5E8B3C02F5D5BA42E401EB3E82C8B.pdf; Supplier: LCSC; Type: 薄膜电阻; Tolerance: ±0.1%; Power(Watts): 100mW; Overload Voltage (Max): 75V; Temperature Coefficient: ±25ppm/℃; Operating Temperature Range: -55℃~+155℃
R29 = RC0603FR-071KL: 电阻类型:厚膜电阻;阻值:1kΩ;精度:±1%;功率:100mW;最大工作电压:75V;温度系数:±100ppm/℃;; LCSC Part Name: 厚膜电阻 1kΩ ±1% 100mW; Supplier Part: C22548; Manufacturer: YAGEO(国巨); Supplier Footprint: 0603; JLCPCB Part Class: 扩展库; Datasheet: https://atta.szlcsc.com/upload/public/pdf/source/20180316/70C0E2BDAE7FCC62C531A5A58D202EE1.pdf; Supplier: LCSC; Type: 厚膜电阻; Tolerance: ±1%; Power(Watts): 100mW; Overload Voltage (Max): 75V; Temperature Coefficient: ±100ppm/℃; Operating Temperature Range: -55℃~+155℃
R30 = ARG05FTC5000: 电阻类型:薄膜电阻;阻值:500Ω;精度:±1%;功率:125mW;最大工作电压:150V;温度系数:±25ppm/℃;; LCSC Part Name: 薄膜电阻 500Ω ±1% 125mW; Supplier Part: C2828857; Manufacturer: Viking(光颉); Supplier Footprint: 0805; JLCPCB Part Class: 扩展库; Datasheet: https://atta.szlcsc.com/upload/public/pdf/source/20210426/C2828737_35D2DDB0BDDA00747C2712435E28BBD4.pdf; Supplier: LCSC; Type: 薄膜电阻; Tolerance: ±1%; Power(Watts): 125mW; Overload Voltage (Max): 150V; Temperature Coefficient: ±25ppm/℃; Operating Temperature Range: -55℃~+155℃
R31 = ARG05FTC0500: 电阻类型:薄膜电阻;阻值:50Ω;精度:±1%;功率:125mW;最大工作电压:150V;温度系数:±25ppm/℃;; LCSC Part Name: 薄膜电阻 50Ω ±1% 125mW; Supplier Part: C2828866; Manufacturer: Viking(光颉); Supplier Footprint: 0805; JLCPCB Part Class: 扩展库; Datasheet: https://atta.szlcsc.com/upload/public/pdf/source/20211009/C2828883_CAE7D170B8B230FC4A048BDC7B3A81FC.pdf; Supplier: LCSC; Type: 薄膜电阻; Tolerance: ±1%; Power(Watts): 125mW; Overload Voltage (Max): 150V; Temperature Coefficient: ±25ppm/℃; Operating Temperature Range: -55℃~+155℃
R33 = 0805W8F1002T5E_C17414: 电阻类型:厚膜电阻;阻值:10kΩ;精度:±1%;功率:125mW;最大工作电压:150V;温度系数:±100ppm/℃;; LCSC Part Name: 10kΩ ±1% 125mW 厚膜电阻; Supplier Part: C17414; Manufacturer: UNI-ROYAL(厚声); Manufacturer Part: 0805W8F1002T5E; Supplier Footprint: 0805; JLCPCB Part Class: 基础库; Datasheet: https://atta.szlcsc.com/upload/public/pdf/source/20200306/C422600_1E6D84923E4A46A82E41ADD87F860B5C.pdf; Supplier: LCSC; Type: 厚膜电阻; Tolerance: ±1%; Power(Watts): 125mW; Overload Voltage (Max): 150V; Temperature Coefficient: ±100ppm/℃; Operating Temperature Range: -55℃~+155℃
R36 = RC0603FR-073KL: 电阻类型:厚膜电阻;阻值:3kΩ;精度:±1%;功率:100mW;最大工作电压:75V;温度系数:±100ppm/℃;; LCSC Part Name: 厚膜电阻 3kΩ ±1% 100mW; Supplier Part: C126358; Manufacturer: YAGEO(国巨); Supplier Footprint: 0603; JLCPCB Part Class: 扩展库; Datasheet: https://atta.szlcsc.com/upload/public/pdf/source/20170914/C127450_1505359406912967677.pdf; Supplier: LCSC; Type: 厚膜电阻; Tolerance: ±1%; Power(Watts): 100mW; Overload Voltage (Max): 75V; Temperature Coefficient: ±100ppm/℃; Operating Temperature Range: -55℃~+155℃
R37 = RT0805BRD0710KL: 电阻类型:薄膜电阻;阻值:10kΩ;精度:±0.1%;功率:125mW;最大工作电压:150V;温度系数:±25ppm/℃;; LCSC Part Name: 薄膜电阻 10kΩ ±0.1% 125mW; Supplier Part: C110775; Manufacturer: YAGEO(国巨); Supplier Footprint: 0805; JLCPCB Part Class: 扩展库; Datasheet: https://atta.szlcsc.com/upload/public/pdf/source/20171026/C133380_15089840010201058857.pdf; Supplier: LCSC; Type: 薄膜电阻; Tolerance: ±0.1%; Power(Watts): 125mW; Overload Voltage (Max): 150V; Temperature Coefficient: ±25ppm/℃; Operating Temperature Range: -55℃~+155℃
U8 = TL431AIDBZR: 输出类型:可调;输入电压:-;输出电压:2.495V~36V;输出电流:100mA;精度:±1%;; Supplier Part: C23892; Manufacturer: TI(德州仪器); Supplier Footprint: SOT-23; JLCPCB Part Class: 扩展库; Datasheet: https://www.ti.com/cn/lit/gpn/tl431; Supplier: LCSC; Output Type: 可调; Output Voltage: 2.495V~36V; Output Current: 100mA; Tolerance: ±1%; Reference Type: 并联; Minimum Cathode Current for Regulation: 700uA; Operating Temperature: -40℃~+85℃@(Ta)
U9 = TLP293(GB-TPL,E(T: LCSC Part Name: 光电耦合器，红外LED和光电晶体管; Supplier Part: C5331602; Manufacturer: TOSHIBA(东芝); Supplier Footprint: SOIC-4; JLCPCB Part Class: 扩展库; Datasheet: https://atta.szlcsc.com/upload/public/pdf/source/20211010/C2832665_C373B9311E64BC86001144F355737806.pdf; Supplier: LCSC

## Nets
GND: C1.2 C2.2 C3.2 C4.2 C5.2 C6.2 C10.2 C11.2 C12.2 C13.2 C16.2 C17.1 C19.1 C20.2 C27.2 C28.2 C29.2 C30.2 D4.4(-) P4.1 P6.1 R10.2 R24.2 R33.1 R36.1 R37.1 U2.3(A) U5.3(A) U8.3(ANODE) U10.5(GND) U12.3(2A) U12.4(2B) U12.5(3A) U12.6(3B) U12.7(4A) U12.9(5A) U13.1(E) U15.1
Vcc: R4.2 U10.7(VCC)
Ics: Q1.3(S) R35.1 U15.2
PWM: Q1.1(G) U10.6(OUTPUT)
Tin_1: C1.1 C2.1 C3.1 C4.1 C5.1 C6.1 C7.2 C8.2 C9.2 D4.3(+) R1.1 R5.2 U12.1(1A)
Tin_2: D1.2(A) Q1.2(D) U12.2(1B)
To5_2: D2.2(A) U12.10(5B)
To15_2: D3.2(A) U12.8(4B)
Vfb: C15.2 R32.1 R34.1 U10.2(FB)
Vo5r: L6.2 P4.2 R28.2 R31.2 U18.2 U19.2 U20.2 U21.2 U22.2 U23.2 U24.2 U25.2 U26.2 U27.2
Vref: U9.4(Collector) U10.8(VREF) U11.2
$1N637: R1.2 R2.1
$1N640: R2.2 R3.1
$1N643: R3.2 R4.1
$1N1116: C7.1 C8.1 C9.1 D1.1(K) R5.1
$2N686: L1.2 L4.1
$2N691: L2.1 L4.2
$2N696: L2.2 L5.1
$2N704: L3.1 L5.2
$2N709: L3.2 L6.1
$2N1326: C10.1 L1.1 R7.2 R8.1 R27.1 U2.2(K) U3.1(C)
$2N1568: R8.2 R10.1 R27.2 U2.1(R)
$2N2913: U3.2(A) U18.1 U19.1 U20.1 U21.1 U22.1 U23.1 U24.1 U25.1 U26.1 U27.1
$2N4108: C27.1 C28.1 C29.1 C30.1 D2.1(K) R7.1
$3N1368: C11.1 C12.1 D3.1(K) U4.1
$3N1567: R22.2 R23.2 R24.1 U5.1(R)
$3N1861: L7.2 L10.1
$3N1865: L8.1 L10.2
$3N1869: L8.2 L11.1
$3N1873: L9.1 L11.2
$3N1877: L9.2 L12.1
$3N2228: L13.2 L15.1
$3N2232: L14.1 L15.2
$3N2238: L12.2 L13.1
$3N2397: R25.1 R26.1 U6.2(A)
$3N2401: C13.1 L7.1 R22.1 R23.1 U4.2 U5.2(K) U6.1(C)
$3N2451: L14.2 P6.2 R25.2 R26.2
$4N454: C14.1 R29.1 U8.1(CATHODE) U9.2(Cathode)
$4N580: R29.2 R30.1 U9.1(Anode)
$4N592: R30.2 R31.1
$4N773: R32.2 R33.2 U9.3(Emitter)
$4N1541: C14.2 R28.1 R36.2 R37.2 U8.2(REF)
$5N227: C15.1 R34.2 U10.1(COMP)
$5N394: C16.1 R35.2 U10.3(ISENSE)
$5N513: C17.2 U10.4(RT/CT) U11.1
$6N214: U13.3(L) U14.1(1A)
$6N220: U13.2(N) U14.2(1B)
$6N226: U14.3(2A) U14.4(2B) U14.5(3A)
$6N243: U14.6(3B) U14.7(4A) U14.8(4B)
$6N652: C18.2 L16.1 L17.1 L18.1 U14.9(5A)
$6N661: C18.1 L19.1 L20.1 L21.1 U14.10(5B)
$6N1202: C19.2 D4.2(AC) L16.2 L17.2 L18.2
$6N1209: C20.1 D4.1(AC) L19.2 L20.2 L21.2

# Board PCB1
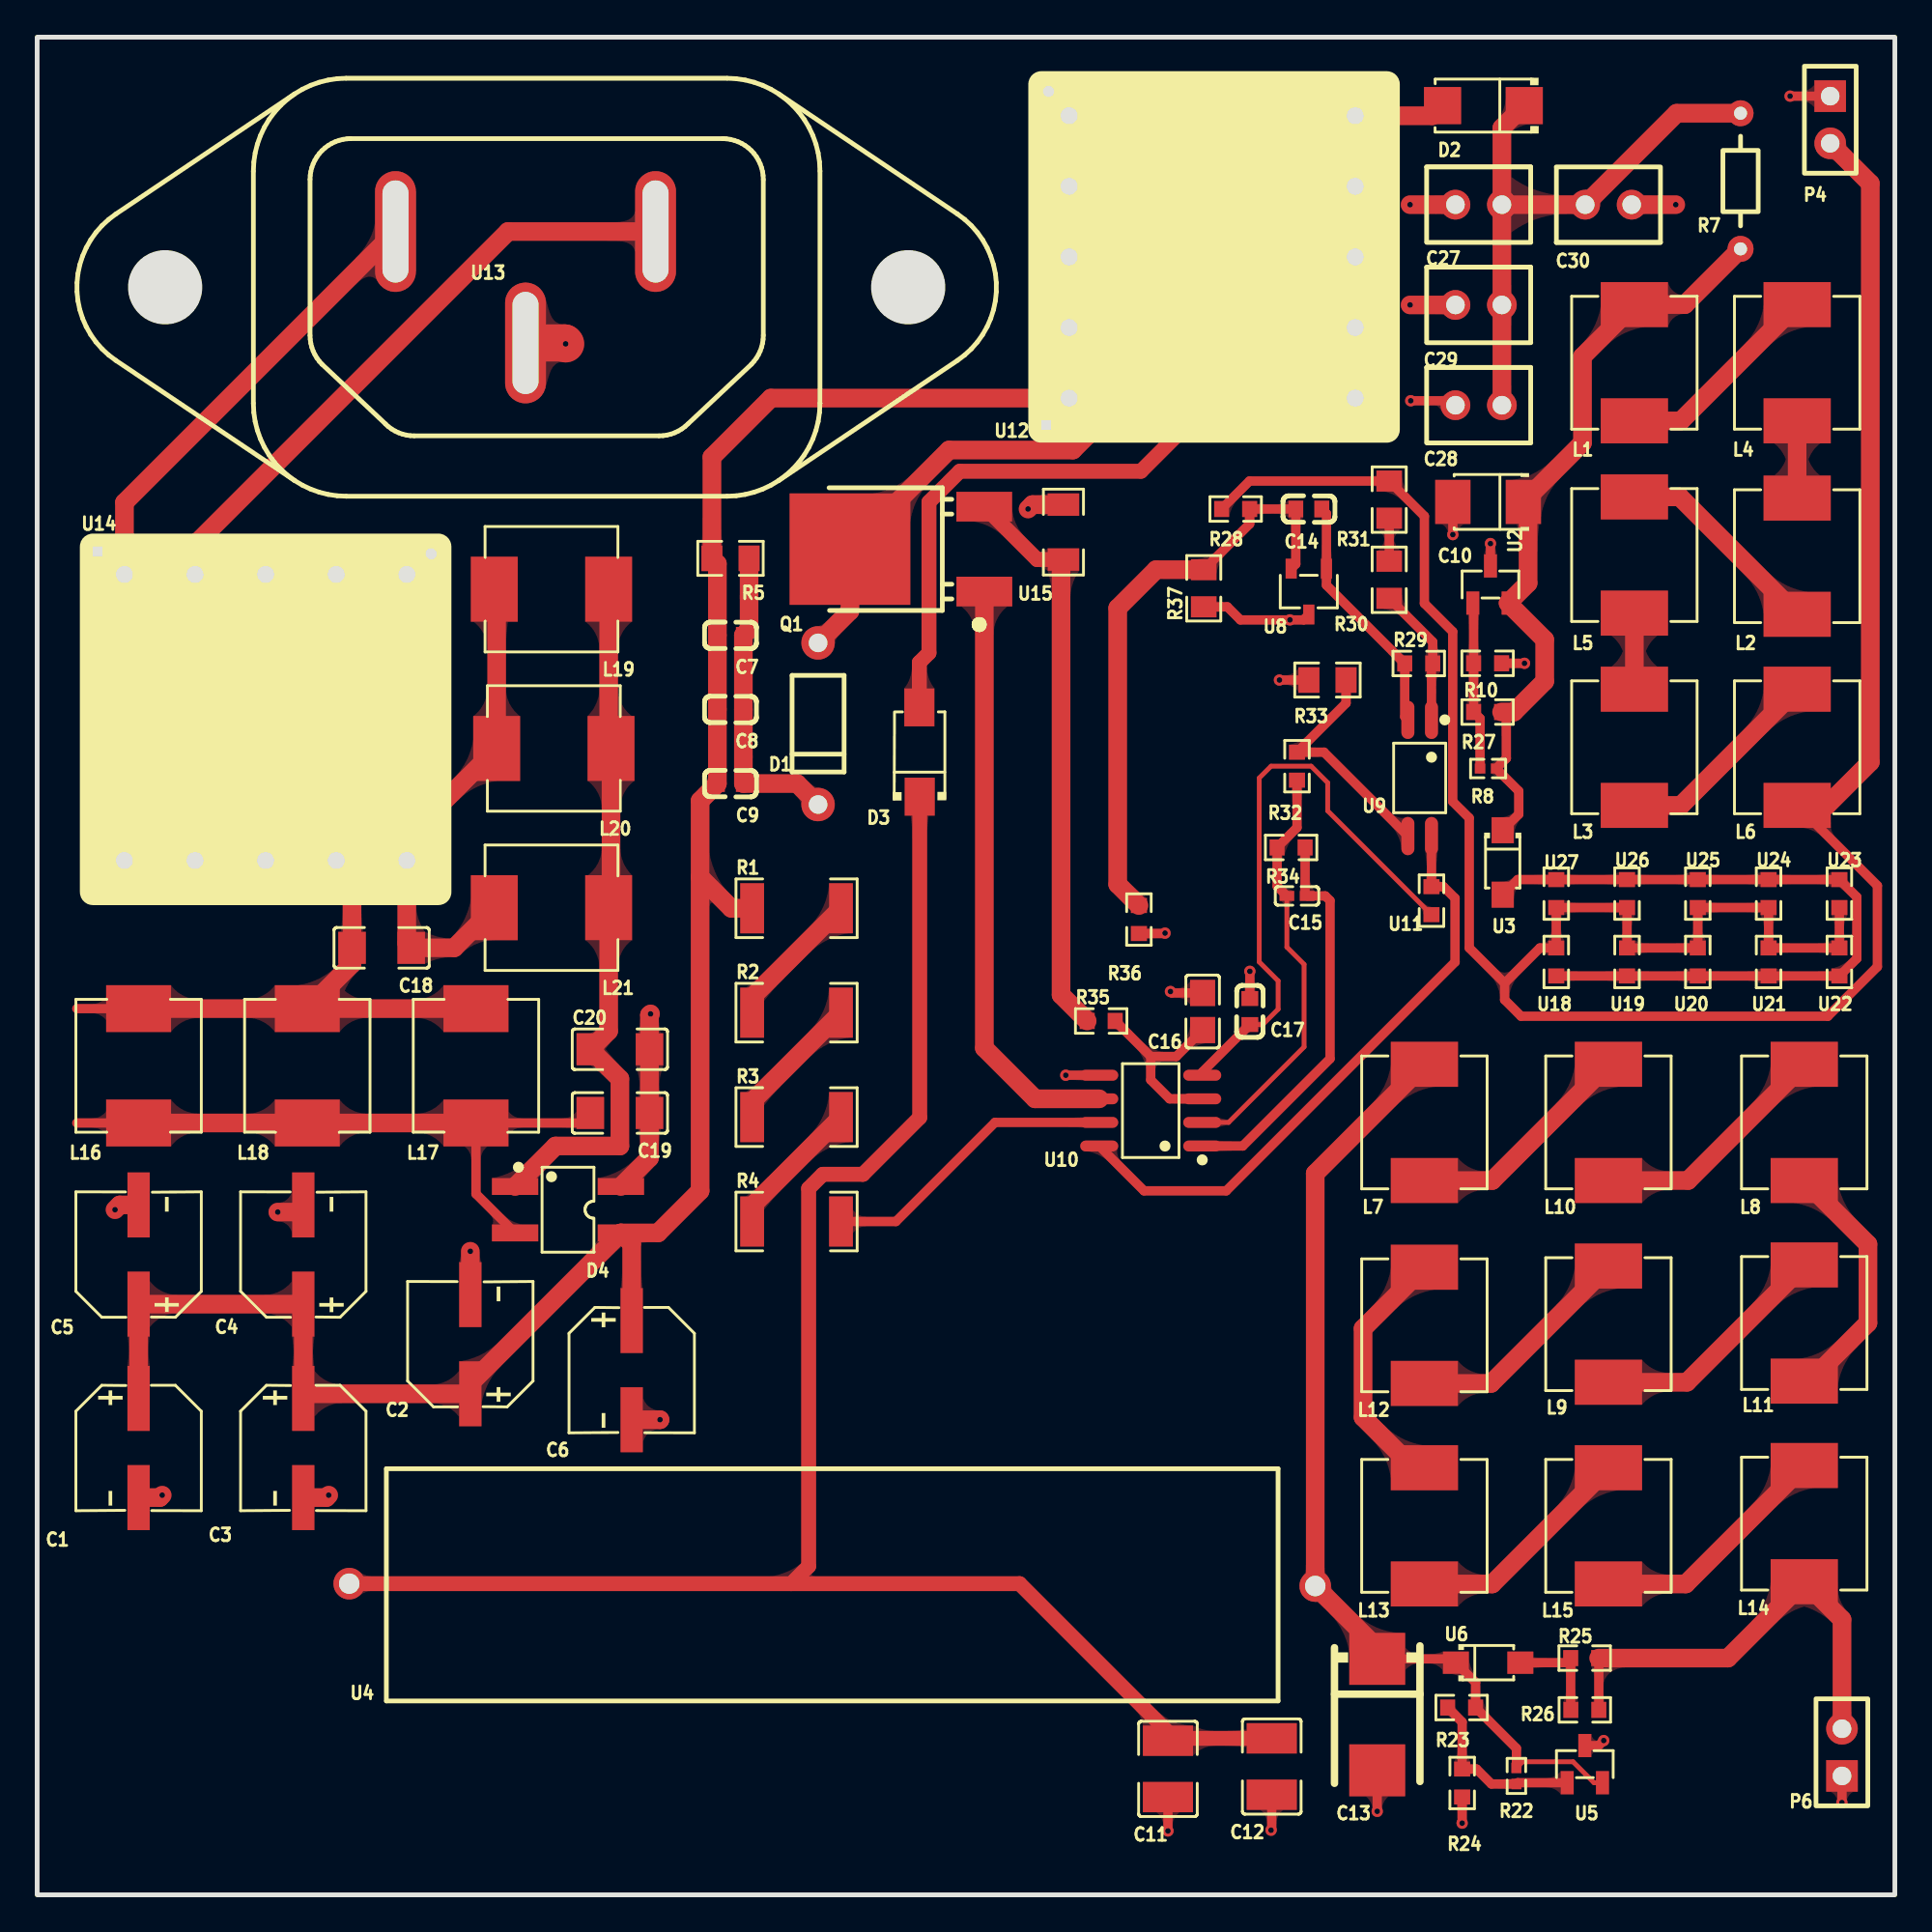
[diagram p6: board, top side]
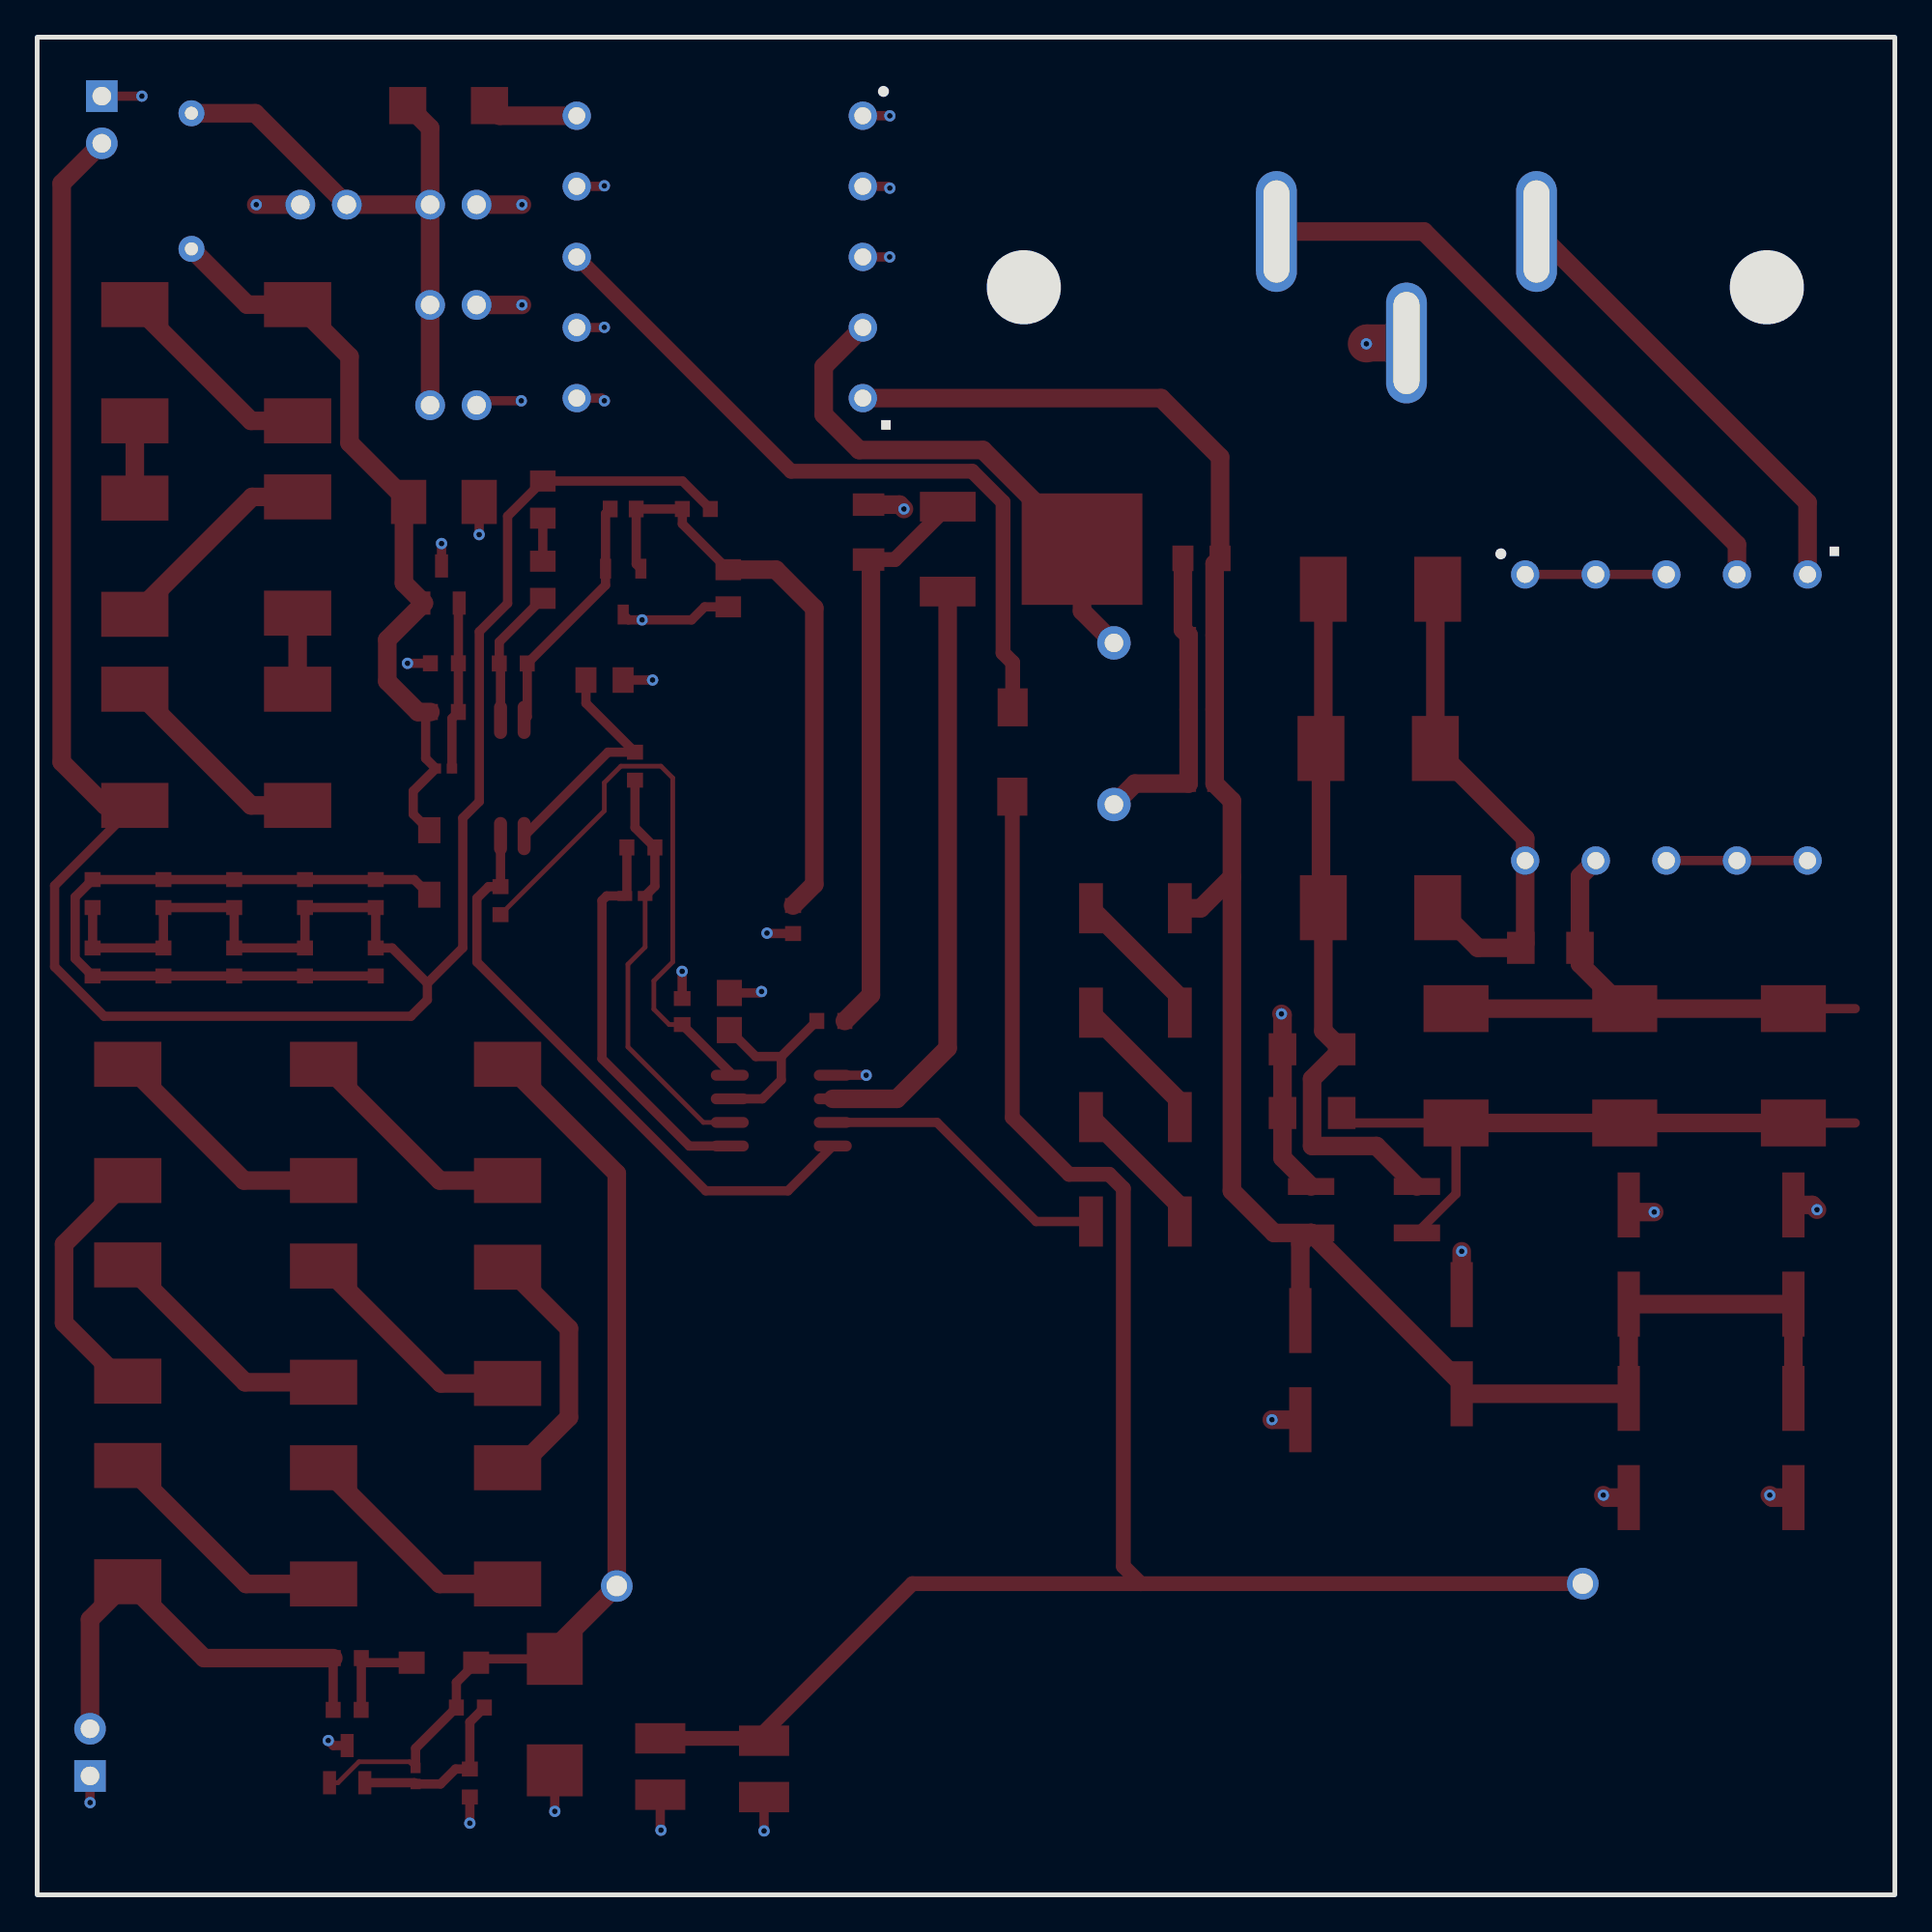
[diagram p7: board, bottom side, seen from below]

Outline 100 x 100 mm; copper layers: Top Layer, Bottom Layer. Coordinates in mm from the lower left corner of the outline.
Outline path: rectangle 0,100 100,0
Stack: Top Layer 0.035mm / Dielectric1 1.51mm FR4 er 4.5 / Bottom Layer 0.035mm

## Design rules (mm)
template: 自定义配置
spacing copperThickness1oz (default): track to track 0.102, other pairs 0.152 to 0.3
spacing copperThickness2oz: track to track 0.203, other pairs 0.152 to 0.3
track width copperThickness1oz (default): min 0.127, default 0.254, max 2.54
track width copperThickness2oz: min 0.203, default 0.254, max 2.54
track width 反激电源_电源线: min 0.127, default 0.762, max 2.54
differential pair differentialPair (default): width min 0.127, default 0.254, max 2.54; gap min 0.152, default 0.152
via viaSize (default): diameter min 0.5, default 0.61, max 10; hole min 0.3, default 0.305, max 6.299
net GND uses 反激电源_电源线
net VCC uses 反激电源_电源线
net VO5R uses 反激电源_电源线
net $6N214 uses 反激电源_电源线
net $6N220 uses 反激电源_电源线

## Placement (name value [footprint] x y rotation side)
C1  100uF  [CAP-SMD_BD6.3-L6.6-W6.6-LS7.4-FD]  5.46 24.05 270 top
C2  100uF  [CAP-SMD_BD6.3-L6.6-W6.6-LS7.4-FD]  14.33 24.05 270 top
C3  100uF  [CAP-SMD_BD6.3-L6.6-W6.6-LS7.4-FD]  23.32 29.64 90 top
C4  100uF  [CAP-SMD_BD6.3-L6.6-W6.6-LS7.4-FD]  14.33 34.47 90 top
C5  100uF  [CAP-SMD_BD6.3-L6.6-W6.6-LS7.4-FD]  5.46 34.47 90 top
C6  100uF  [CAP-SMD_BD6.3-L6.6-W6.6-LS7.4-FD]  32 28.25 270 top
C7  100nF  [C0603]  37.32 67.8 180 top
C8  100nF  [C0603]  37.32 63.81 180 top
C9  100nF  [C0603]  37.32 59.82 180 top
C10  100uF  [CAP-SMD_L3.5-W2.8-R-RD]  78.1 74.98 0 top
C11  10uF  [C1210]  60.87 6.78 270 top
C12  10uF  [C1210]  66.46 6.91 270 top
C13  100uF  [CASE-D_7343]  72.14 9.7 90 top
C14  100nF  [C0603]  68.45 74.6 180 top
C15  3nF  [C0402]  67.82 53.77 180 top
C16  470pF  [C0805]  62.74 47.55 90 top
C17  2.2nF  [C0603]  65.28 47.55 270 top
C18  1uF  [C1206]  18.54 50.98 180 top
C19  1uF  [C1206]  31.37 42.09 180 top
C20  1uF  [C1206]  31.37 45.52 0 top
C27  15uF  [CAP-TH_L5.5-W4.0-P2.50-D1.0]  77.6 90.98 180 top
C28  15uF  [CAP-TH_L5.5-W4.0-P2.50-D1.0]  77.6 80.19 180 top
C29  15uF  [CAP-TH_L5.5-W4.0-P2.50-D1.0]  77.6 85.59 180 top
C30  15uF  [CAP-TH_L5.5-W4.0-P2.50-D1.0]  84.58 90.98 0 top
D1  UF4007  [DO-41_BD2.4-L4.7-P8.70-D0.9-RD]  42.04 63.04 90 top
D2  SS32  [SMA_L4.3-W2.6-LS5.2-RD]  77.85 96.32 180 top
D3  SS38  [SMA_L4.3-W2.6-LS5.0-RD]  47.5 61.52 90 top
D4  MB2S  [MBS_L4.7-W4.0-P2.50-LS7.0-BL]  28.57 36.88 270 top
L1  33uH  [IND-SMD_L7.0-W6.6_FXL0630]  85.98 82.47 90 top
L2  33uH  [IND-SMD_L7.0-W6.6_FXL0630]  94.74 72.06 90 top
L3  33uH  [IND-SMD_L7.0-W6.6_FXL0630]  85.98 61.77 90 top
L4  33uH  [IND-SMD_L7.0-W6.6_FXL0630]  94.74 82.47 90 top
L5  33uH  [IND-SMD_L7.0-W6.6_FXL0630]  85.98 72.12 90 top
L6  33uH  [IND-SMD_L7.0-W6.6_FXL0630]  94.74 61.77 90 top
L7  33uH  [IND-SMD_L7.0-W6.6_FXL0630]  74.68 41.58 90 top
L8  33uH  [IND-SMD_L7.0-W6.6_FXL0630]  95.12 41.58 90 top
L9  33uH  [IND-SMD_L7.0-W6.6_FXL0630]  84.58 30.72 270 top
L10  33uH  [IND-SMD_L7.0-W6.6_FXL0630]  84.58 41.58 90 top
L11  33uH  [IND-SMD_L7.0-W6.6_FXL0630]  95.12 30.78 270 top
L12  33uH  [IND-SMD_L7.0-W6.6_FXL0630]  74.68 30.66 270 top
L13  33uH  [IND-SMD_L7.0-W6.6_FXL0630]  74.68 19.86 90 top
L14  33uH  [IND-SMD_L7.0-W6.6_FXL0630]  95.12 19.98 90 top
L15  33uH  [IND-SMD_L7.0-W6.6_FXL0630]  84.58 19.86 90 top
L16  33uH  [IND-SMD_L7.0-W6.6_FXL0650]  5.46 44.63 90 top
L17  33uH  [IND-SMD_L7.0-W6.6_FXL0650]  23.62 44.63 90 top
L18  33uH  [IND-SMD_L7.0-W6.6_FXL0650]  14.54 44.63 90 top
L19  33uH  [IND-SMD_L7.0-W6.6_FXL0650]  27.69 70.28 180 top
L20  33uH  [IND-SMD_L7.0-W6.6_FXL0650]  27.81 61.71 180 top
L21  33uH  [IND-SMD_L7.0-W6.6_FXL0650]  27.69 53.14 180 top
P4  2.54-1*2P母  [HDR-TH_2P-P2.54-V-F]  96.52 95.56 270 top
P6  2.54-1*2P母  [HDR-TH_2P-P2.54-V-F]  97.16 7.67 90 top
Q1  IRFR220NTRPBF  [TO-252-2_L6.6-W6.1-P4.57-LS9.9-TR-CW]  47.37 72.44 270 top
R1  100Ω  [R2010]  40.88 53.11 0 top
R2  100Ω  [R2010]  40.88 47.49 0 top
R3  100Ω  [R2010]  40.88 41.87 0 top
R4  100Ω  [R2010]  40.88 36.25 0 top
R5  50kΩ  [R0805]  37.32 71.94 180 top
R7  1.5Ω  [RES-TH_BD1.9-L3.3-P7.30-D0.5]  91.69 92.25 270 top
R8  3kΩ  [R0402]  78.1 60.63 180 top
R10  2.5kΩ  [R0603]  78.08 66.29 0 top
R22  3kΩ  [R0402]  79.63 6.4 270 top
R23  10kΩ  [R0603]  76.68 10.08 180 top
R24  2.5kΩ  [R0603]  76.71 6.02 270 top
R25  100Ω  [R0603]  83.3 12.74 0 top
R26  100Ω  [R0603]  83.31 9.96 0 top
R27  15kΩ  [R0603]  78.08 63.67 180 top
R28  20kΩ  [R0603]  64.52 74.6 180 top
R29  1kΩ  [R0603]  74.37 66.28 0 top
R30  500Ω  [R0805]  72.78 70.79 90 top
R31  50Ω  [R0805]  72.78 75.11 90 top
R32  1kΩ  [R0603]  67.82 60.76 90 top
R33  10kΩ  [R0805]  69.46 65.39 0 top
R34  1kΩ  [R0603]  67.5 56.38 0 top
R35  1kΩ  [R0603]  57.28 47.04 0 top
R36  3kΩ  [R0603]  59.31 52.5 90 top
R37  10kΩ  [R0805]  62.8 70.33 90 top
U2  TL431A  [SOT-23-3_L2.9-W1.3-P1.90-LS2.4-BR]  78.23 70.54 270 top
U3  DS12W-MS  [SOD-123FL_L2.7-W1.8-LS3.8-RD]  78.89 55.57 270 top
U4  15Ω  [RES-TH_L48.0-W12.5-P52.00-D0.8]  42.8 16.69 0 top
U5  TL431A  [SOT-23-3_L2.9-W1.3-P1.90-LS2.4-BR]  83.31 7.04 270 top
U6  DS12W-MS  [SOD-123FL_L2.7-W1.8-LS3.8-RD]  78.1 12.5 0 top
U8  TL431AIDBZR  [SOT-23-3_L2.9-W1.6-P1.90-LS2.8-BR]  68.45 70.16 90 top
U9  TLP293(GB-TPL,E(T  [SO-4_L4.6-W2.6-P1.27-LS7.0]  74.42 60.12 270 top
U10  UC3842AD8TR  [SOIC-8_L4.9-W3.9-P1.27-LS6.0-BL]  59.94 42.22 90 top
U11  8.87kΩ  [R0603]  75.06 53.52 90 top
U12  -  [反激变压器_封装]  70.95 80.57 90 top
U13  RT-C14-C0B-AA  [AC-TH_RT-C14-C0B-AA]  26.29 86.54 180 top
U14  -  [反激变压器_封装]  4.7 55.68 0 top
U15  70mΩ  [R1206]  55.25 73.36 270 top
U18  50Ω  [R0603]  81.77 50.22 90 top
U19  50Ω  [R0603]  85.58 50.22 90 top
U20  50Ω  [R0603]  89.39 50.22 90 top
U21  50Ω  [R0603]  93.2 50.22 90 top
U22  50Ω  [R0603]  97.01 50.22 90 top
U23  50Ω  [R0603]  97.01 53.9 270 top
U24  50Ω  [R0603]  93.2 53.9 270 top
U25  50Ω  [R0603]  89.39 53.9 270 top
U26  50Ω  [R0603]  85.58 53.9 270 top
U27  50Ω  [R0603]  81.77 53.9 270 top

## Footprints (pads in the part's own frame, mm; a bottom-side part is the same pattern mirrored in y, then rotated)
AC-TH_RT-C14-C0B-AA
  oval 2.2x6.5 hole 1.4x5.5: 1(0,3) 2(-7,-3) 3(7,-3)
C0402
  rect 0.79x0.54 smd: 1(-0.545,0) 2(0.545,0)
C0603
  rect 0.8x0.9 smd: 1(-0.7,0) 2(0.7,0)
C0805
  rect 1.41x1.35 smd: 1(-1,0) 2(1,0)
C1206
  rect 1.485x1.728 smd: 1(-1.593,0) 2(1.593,0)
C1210
  rect 1.635x2.7 smd: 1(-1.518,0) 2(1.518,0)
CAP-SMD_BD6.3-L6.6-W6.6-LS7.4-FD
  rect 3.5x1.2 smd: 1(-2.67,0) 2(2.67,0)
CAP-SMD_L3.5-W2.8-R-RD
  rect 1.9x2.376 smd: 1(1.899,0) 2(-1.899,0)
CAP-TH_L5.5-W4.0-P2.50-D1.0
  round 1.6 hole 1: 1(-1.25,0) 2(1.25,0)
CASE-D_7343
  rect 2.799x3.01 smd: 1(3,0) 2(-3,0)
DO-41_BD2.4-L4.7-P8.70-D0.9-RD
  round 1.8 hole 1: 1(-4.35,0) 2(4.35,0)
HDR-TH_2P-P2.54-V-F
  rect 1.7x1.7 hole 1: 1(-1.27,0)
  round 1.7 hole 1: 2(1.27,0)
IND-SMD_L7.0-W6.6_FXL0630
  rect 2.424x3.62 smd: 1(3.128,0) 2(-3.128,0)
IND-SMD_L7.0-W6.6_FXL0650
  rect 2.524x3.5 smd: 1(3.078,0) 2(-3.078,0)
MBS_L4.7-W4.0-P2.50-LS7.0-BL
  rect 0.91x2.495 smd: 1(-1.25,-2.848) 2(1.25,-2.848) 3(1.25,2.848) 4(-1.25,2.848)
R0402
  rect 0.566x0.54 smd: 1(-0.433,0) 2(0.433,0)
R0603
  rect 0.806x0.864 smd: 1(-0.753,0) 2(0.753,0)
R0805
  rect 1.133x1.377 smd: 1(-1,0) 2(1,0)
R1206
  rect 1.208x1.701 smd: 1(-1.479,0) 2(1.479,0)
R2010
  rect 1.282x2.7 smd: 1(-2.391,0) 2(2.391,0)
RES-TH_BD1.9-L3.3-P7.30-D0.5
  round 1.4 hole 0.7: 1(-3.65,0) 2(3.65,0)
RES-TH_L48.0-W12.5-P52.00-D0.8
  round 1.7 hole 1.1: 1(-26,0.064) 2(26,-0.064)
SMA_L4.3-W2.6-LS5.0-RD
  rect 2.046x1.62 smd: 1(-2.404,-0.009) 2(2.404,0.009)
SMA_L4.3-W2.6-LS5.2-RD
  rect 2x2 smd: 1(-2.2,0) 2(2.2,0)
SO-4_L4.6-W2.6-P1.27-LS7.0
  oval 2.056x0.7 smd: 1(-3.128,0.635) 2(-3.128,-0.635) 3(3.128,-0.635) 4(3.128,0.635)
SOD-123FL_L2.7-W1.8-LS3.8-RD
  rect 1.4x1.2 smd: 1(-1.735,0) 2(1.735,0)
SOIC-8_L4.9-W3.9-P1.27-LS6.0-BL
  oval 0.588x2.045 smd: 1(-1.905,-2.772) 2(-0.635,-2.772) 3(0.635,-2.772) 4(1.905,-2.772) 5(1.905,2.772) 6(0.635,2.772) 7(-0.635,2.772) 8(-1.905,2.772)
SOT-23-3_L2.9-W1.3-P1.90-LS2.4-BR
  rect 1.25x0.7 smd: 1(1,-0.95) 2(1,0.95) 3(-1,0)
SOT-23-3_L2.9-W1.6-P1.90-LS2.8-BR
  rect 1.07x0.6 smd: 1(1.235,-0.95) 2(1.235,0.95) 3(-1.235,0)
TO-252-2_L6.6-W6.1-P4.57-LS9.9-TR-CW
  rect 1.6x3 smd: 1(2.285,3.617) 3(-2.285,3.611)
  rect 6x6.5 smd: 2(0.001,-3.617)
反激变压器_封装
  round 1.524 hole 0.914: 1(0,15.4) 2(3.8,15.4) 3(7.6,15.4) 4(11.4,15.4) 5(15.2,15.4) 6(0,0) 7(3.8,0) 8(7.6,0) 9(11.4,0) 10(15.2,0)

## Nets
As in the schematic, except:
VCC: R4.2 U10.7
ICS: Q1.3 R35.1 U15.2
TIN_1: C1.1 C2.1 C3.1 C4.1 C5.1 C6.1 C7.2 C8.2 C9.2 D4.3 R1.1 R5.2 U12.1
TIN_2: D1.2 Q1.2 U12.2
TO5_2: D2.2 U12.10
TO15_2: D3.2 U12.8
VFB: C15.2 R32.1 R34.1 U10.2
VO5R: L6.2 P4.2 R28.2 R31.2 U18.2 U19.2 U20.2 U21.2 U22.2 U23.2 U24.2 U25.2 U26.2 U27.2
VREF: U9.4 U10.8 U11.2

## Via types
v1: diameter 0.61, hole 0.305, Top Layer to Bottom Layer, 35 vias

## Routing (per net, layer and track width the routed paths; a pad name or vN(x,y) marks a point on that pad's centre or on a via; arc(x,y) is an arc through that point)
GND: length 72.7
  Top Layer w0.5: U10.5 v1(55.37,44.12) ; C12.2 66.46,3.52 v1(66.42,3.48) ; C28.2 76.11,80.43 v1(73.94,80.43) ; R10.2 v1(80.06,66.29) ; v1(54.1,91.87) 54.2,91.97 55.55,91.97 ; U5.3 84.06,8.04 v1(84.33,8.31) ; v1(61.01,48.63) 61.08,48.55 C16.2 ; U12.7 69.48,84.37 v1(69.47,84.38) ; 65.28,48.25 65.28,48.25 v1(65.28,49.71) ; v1(69.47,80.43) 69.61,80.57 U12.6 ; v1(69.47,92) 69.5,91.97 70.95,91.97 ; U12.5 54.11,95.77 v1(54.1,95.77) ; v1(97.15,4.97) 97.16,4.97 P6.1 ; R37.1 64.07,69.33 64.77,68.63 v1(67.44,68.63) 68.16,68.63 U8.3 ; v1(78.23,72.74) U2.3 ; 96.52,96.83 v1(94.36,96.83) ; R33.1 v1(66.87,65.39) ; C11.2 v1(60.87,3.44) ; R36.1 60.69,51.75 v1(60.71,51.77) ; C13.2 v1(72.14,4.5) ; R24.2 v1(76.71,3.86) ; U12.3 v1(54.11,88.17) ; C10.2 v1(76.21,73.22)
  Top Layer w1: C3.2 v1(23.32,34.64) ; U15.1 53.58,74.84 v1(53.34,74.6) ; v1(33.02,47.42) 32.96,47.36 C20.2 C19.1 32.96,39.67 D4.4 ; v1(15.69,21.51) 15.56,21.38 C2.2 ; C27.2 v1(73.91,90.98) ; C29.2 v1(73.91,85.59) ; v1(33.53,25.58) 33.53,25.57 C6.2 ; C30.2 v1(88.21,90.98) ; v1(12.95,36.75) 13.94,36.75 C4.2 ; C1.2 6.6,21.38 v1(6.73,21.51) ; v1(4.19,36.88) 4.45,37.14 C5.2
  Top Layer w2: v1(28.45,83.49) 28.4,83.54 U13.1
VCC: length 16.1
  Top Layer w0.5: 43.27,36.25 46.23,36.25 51.56,41.58 U10.7
ICS: length 30.9
  Top Layer w0.8: Q1.3 53.83,71.88 U15.2
  Top Layer w1: U15.2 55.12,71.75 55.12,48.45 R35.1
PWM: length 31.9
  Top Layer w1: Q1.1 50.99,45.58 53.72,42.85 U10.6
TIN_1: length 114.3
  Top Layer w1: U12.1 39.5,80.57 36.32,77.39 36.32,71.95 ; R1.1 37.37,53.11 35.69,54.79 ; D4.3 23.32,27.53 C3.1 14.57,26.97 14.33,26.72 C4.1 C5.1 C1.1 ; D4.3 32,35.05 C6.1 ; D4.3 33.42,35.63 35.69,37.9 35.69,54.79 ; R5.2 36.62,71.65 C7.2 C8.2 C9.2 35.69,58.89 35.69,54.79
TIN_2: length 28.2
  Top Layer w1: U12.2 57.66,82.26 57.66,79.68 55.75,77.78 49.09,77.78 Q1.2 43.75,69.11 D1.2
TO5_2: length 4.9
  Top Layer w1: D2.2 75.1,95.77 U12.10
TO15_2: length 39.7
  Top Layer w0.8: U12.8 59.42,76.63 49.66,76.63 48.01,74.97 48.01,66.85 47.49,66.34 D3.2
VFB: length 22.6
  Top Layer w0.254: U10.2 64.13,41.58 68.2,45.64 68.2,50.09 67.27,51.02 67.27,53.77
  Top Layer w0.5: R32.1 67.82,57.45 R34.1 66.75,54.3 67.27,53.77
VO5R: length 140.9
  Top Layer w0.5: R28.2 63.76,74.61 65.26,76.11 R31.2 74.68,74.21 74.68,69.52 76.2,68 76.2,58.85 77.09,57.96 77.09,50.98 78.99,49.07 ; L6.2 99.06,54.33 99.06,49.96 96.39,47.3 79.88,47.3 78.99,48.18 78.99,49.07 ; U23.2 U22.2 U21.2 U24.2 U25.2 U20.2 U19.2 U26.2 U27.2 U18.2 80.89,50.97 78.99,49.07
  Top Layer w1: 96.52,94.28 98.68,92.13 98.68,60.98 96.35,58.64 L6.2
VREF: length 32.9
  Top Layer w0.5: U10.8 59.58,37.9 64.01,37.9 76.33,50.22 76.33,53.64 75.7,54.27 U11.2 U9.4
$1N637: length 7.6
  Top Layer w1: 43.27,53.11 38.49,48.33 R2.1
$1N640: length 7.6
  Top Layer w1: R3.1 38.49,42.7 43.27,47.49
$1N643: length 7.6
  Top Layer w1: 43.27,41.87 38.49,37.08 R4.1
$1N1116: length 16.7
  Top Layer w1: R5.1 38.32,68.11 C7.1 C8.1 C9.1 40.91,59.82 42.04,58.69
$2N686: length 11.4
  Top Layer w1: L1.2 88.49,79.35 L4.1
$2N691: length 4.2
  Top Layer w1: L4.2 L2.1
$2N696: length 11.4
  Top Layer w1: L2.2 88.42,75.25 L5.1
$2N704: length 4.1
  Top Layer w1: L5.2 L3.1
$2N709: length 11.4
  Top Layer w1: L3.2 88.49,58.64 L6.1
$2N1326: length 41.6
  Top Layer w0.5: U3.1 79.76,58.17 79.76,59.41 R8.1 79.09,61.18 79.09,63.42 R27.1
  Top Layer w1: R27.1 79.5,63.67 81.15,65.33 81.15,67.56 U2.2 80.26,70.61 80.26,74.73 C10.1 83.19,78.16 83.19,82.81 L1.1 88.69,85.6 R7.2
$2N1568: length 9.1
  Top Layer w0.5: U2.1 77.32,69.49 R10.1 R27.2 77.67,63.33 R8.2
$2N2913: length 39.7
  Top Layer w0.5: U18.1 U19.1 U20.1 U21.1 U22.1 97.95,50.4 97.95,53.71 U23.1 U24.1 U25.1 U26.1 U27.1 79.7,54.65 U3.2
$2N4108: length 31.5
  Top Layer w1: C27.1 C30.1 88.25,95.9 R7.1 ; C27.1 C29.1 C28.1 ; C27.1 78.85,95.11 D2.1
$3N1368: length 100
  Top Layer w0.5: C11.1 61,8.42 61.21,8.42
  Top Layer w0.8: D3.1 47.51,41.84 44.45,38.79 42.29,38.79 41.53,38.02 41.53,17.69 40.59,16.75 ; 40.59,16.75 52.88,16.75 61.21,8.42 C12.1 ; 40.59,16.75 U4.1
$3N1567: length 9.6
  Top Layer w0.5: R23.2 76.71,9.3 R24.1 77.48,6.77 78.28,5.97 R22.2 79.7,6.04 U5.1
$3N1861: length 12.5
  Top Layer w1: L7.2 78.33,38.45 L10.1
$3N1865: length 13.1
  Top Layer w1: L10.2 88.87,38.45 L8.1
$3N1869: length 13.8
  Top Layer w1: L8.2 98.55,35.02 98.55,30.78 95.42,27.65 L11.1
$3N1873: length 13.2
  Top Layer w1: L9.1 88.81,27.59 L11.2
$3N1877: length 12.5
  Top Layer w1: L9.2 78.26,27.53 L12.1
$3N2228: length 12.5
  Top Layer w1: L13.2 78.33,16.74 L15.1
$3N2232: length 13.2
  Top Layer w1: L15.2 88.75,16.74 L14.1
$3N2238: length 13.9
  Top Layer w1: L12.2 71.37,30.48 71.37,25.71 74.09,22.99 L13.1
$3N2397: length 5.6
  Top Layer w0.5: U6.2 82.3,12.5 R25.1 82.55,9.97 R26.1
$3N2401: length 52.4
  Top Layer w0.254: R22.1 79.96,7.16 82.68,7.16 83.8,6.04 U5.2
  Top Layer w0.5: C13.1 76.16,12.7 U6.1 77.43,11.43 R23.1 79.63,7.89 R22.1
  Top Layer w1: C13.1 72.14,13.29 U4.2 68.8,38.83 L7.1
$3N2451: length 24.3
  Top Layer w0.5: R26.2 84.07,12.74 84.06,12.74
  Top Layer w1: P6.2 97.16,14.82 L14.2 91.01,12.74 84.06,12.74
$4N454: length 13.3
  Top Layer w0.5: C14.1 69.4,74.35 U8.1 69.4,70.5 R29.1 73.62,63.42 U9.2
$4N580: length 7.5
  Top Layer w0.5: U9.1 75.06,66.22 R29.2 75.12,67.45 R30.1
$4N592: length 2.3
  Top Layer w0.5: R31.1 R30.2
$4N773: length 12.8
  Top Layer w0.5: U9.3 69.27,61.51 R32.2 70.46,64.15 R33.2
$4N1541: length 32.1
  Top Layer w0.5: 62.74,71.27 65.27,73.8 R28.1 C14.2 67.75,71.64 U8.2
  Top Layer w1: R37.2 60.23,71.33 58.17,69.27 58.17,54.4 R36.2
$5N227: length 21.3
  Top Layer w0.5: U10.1 64.9,40.31 69.6,45.01 69.6,53.52 69.34,53.77 C15.1 68.25,53.88 R34.2
$5N394: length 10.5
  Top Layer w0.5: 59.94,45.13 59.94,43.87 60.96,42.85 U10.3 ; 59.94,45.13 R35.2 ; 59.94,45.13 61.32,45.13 C16.1
$5N513: length 32.3
  Top Layer w0.254: C17.2 65.97,46.85 66.8,47.68 66.8,49.2 65.79,50.22 65.79,60.12 66.42,60.76 68.58,60.76 69.47,59.87 69.47,58.35 U11.1
  Top Layer w0.5: C17.2 62.72,44.29 U10.4
$6N214: length 24.5
  Top Layer w1: 4.7,71.08 4.7,74.95 U13.3
$6N220: length 33.4
  Top Layer w1: 8.5,71.08 8.5,72.69 25.35,89.54 U13.2
$6N226: length 7.6
  Top Layer w0.5: 12.3,71.08 19.9,71.08
$6N243: length 7.6
  Top Layer w0.5: 12.3,55.68 U14.7 U14.6
$6N652: length 30.8
  Top Layer w0.5: L16.1 2.14,47.71
  Top Layer w1: L18.1 L16.1 ; L18.1 16.95,50.11 C18.2 16.95,54.83 U14.9 ; L18.1 L17.1
$6N661: length 26.8
  Top Layer w1: L21.1 22.45,50.98 C18.1 19.9,51.21 U14.10 19.9,56.87 L20.1 24.73,70.16 L19.1
$6N1202: length 34.7
  Top Layer w0.5: D4.2 23.62,37.74 L17.2 29.24,41.55 C19.2 ; 2.14,41.55 L16.2
  Top Layer w1: L17.2 L18.2 L16.2
$6N1209: length 37.7
  Top Layer w1: D4.1 27.91,40.31 31.37,40.31 31.37,43.92 C20.1 30.76,46.5 L21.2 30.89,53.26 L20.2 30.76,61.84 L19.2

## Copper pours and planes (outline as drawn; the poured copper is in the pictures)
GND on Bottom Layer: 0,100 100,100 100,0 0,0

Small or netless copper shapes (teardrops, artwork), in the pictures only: 288 on Top Layer
